# Altium project VNA.PrjPcb
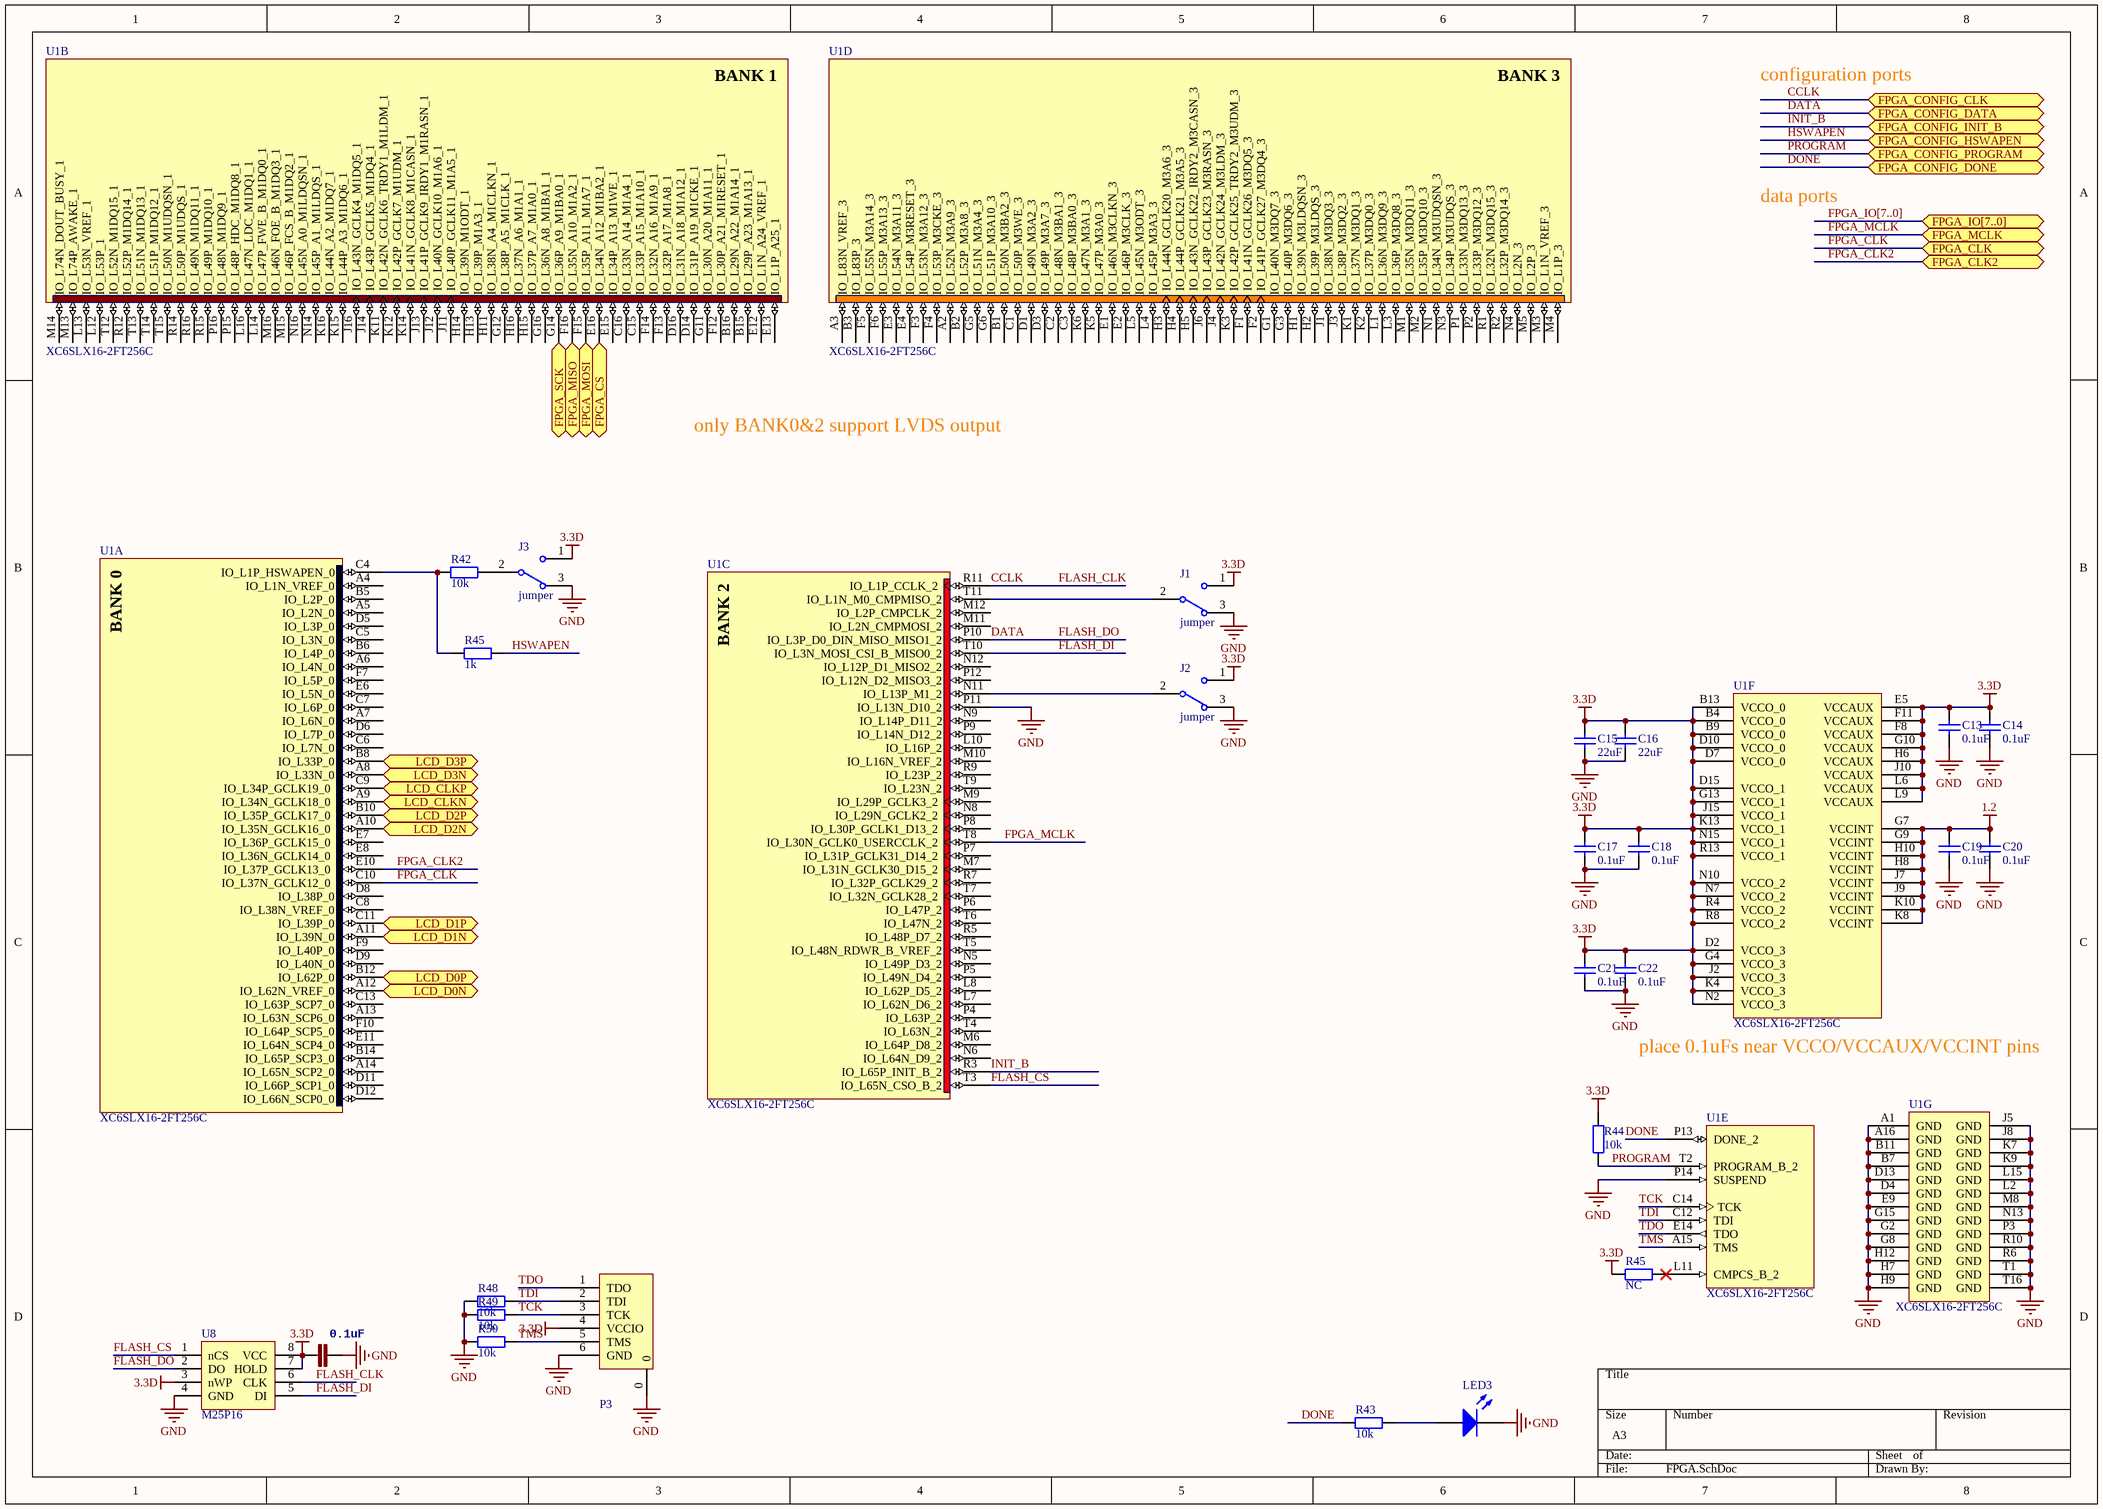
[diagram p0: FPGA.SchDoc]
16 sheets, 580 parts. Net scope: hierarchical (ports join the sheet entries above them; power ports are global).
Board file: VNA.PcbDoc
Sheets:
  FPGA.SchDoc
  mcu.SchDoc
  LCD.SchDoc
  USB_HS_PHY.SchDoc
  channel.SchDoc
    IF1 = IF_amp.SchDoc
    Designator = ADC.SchDoc
    IF2 = IF_amp.SchDoc
    mixer1 = mixer.SchDoc
    mixer2 = mixer.SchDoc
    LO = source.SchDoc
    F1 = filter_bank.SchDoc
    B1 = Balun.SchDoc
    B1 = Balun.SchDoc
    F2 = filter_bank.SchDoc
    TX = source.SchDoc
    F1 = filter_bank.SchDoc
    F2 = RF_AMP.SchDoc
    F1 = filter_bank.SchDoc
    det = detector.SchDoc
    att = attenuator.SchDoc
    sw = port_sw.SchDoc
    LNA2 = LNA.SchDoc
    LNA2 = LNA.SchDoc

## Sheet FPGA.SchDoc
size A3

### Parts
(Parts that share a designator on the sheet are numbered #1, #2 ... from top to bottom, then left to right.)
C13  0.1uF  [0402]
C14  0.1uF  [0402]
C15  value 22uF  [0805]  (hidden comment: Cap)
C16  value 22uF  [0805]  (hidden comment: Cap)
C17  0.1uF  [0402]
C18  0.1uF  [0402]
C19  0.1uF  [0402]
C20  0.1uF  [0402]
C21  0.1uF  [0402]
C22  0.1uF  [0402]
C68  0.1uF  [0402]
J1  jumper  [0402J]
J2  jumper  [0402J]
J3  jumper  [0402J]
LED3  LED0  [0603]  (value not drawn)
P3  JTAG-6P  [GH1.25-6]  (value not drawn)
R42  10k  [0402]
R43  10k  [0402]
R44  10k  [0402]
R45#1  1k  [0402]
R45#2  NC  [0402]
R48  10k  [0402]
R49  10k  [0402]
R50  10k  [0402]
U1  XC6SLX16-2FT256C  [FT256]  (parts A,B,C,D,E,F,G of 7)
U8  M25P16  [SO8]

### Ports
FPGA_CLK, FPGA_CLK2, FPGA_CONFIG_CLK, FPGA_CONFIG_DATA, FPGA_CONFIG_DONE, FPGA_CONFIG_HSWAPEN, FPGA_CONFIG_INIT_B, FPGA_CONFIG_PROGRAM, FPGA_CS, FPGA_IO[7..0], FPGA_MCLK, FPGA_MISO, FPGA_MOSI, FPGA_SCK, LCD_CLKN, LCD_CLKP, LCD_D0N, LCD_D0P, LCD_D1N, LCD_D1P, LCD_D2N, LCD_D2P, LCD_D3N, LCD_D3P

### Nets
1.2: C19.1 C20.1 U1.G7(VCCINT) U1.G9(VCCINT) U1.H8(VCCINT) U1.H10(VCCINT) U1.J7(VCCINT) U1.J9(VCCINT) U1.K8(VCCINT) U1.K10(VCCINT)
3.3D: C13.1 C14.1 C15.2 C16.2 C17.1 C18.1 C21.1 C22.1 C68.2 J1.1 J2.1 J3.1 P3.4(VCCIO) R44.1 R45#2.2 U1.B4(VCCO_0) U1.B9(VCCO_0) U1.B13(VCCO_0) U1.D2(VCCO_3) U1.D7(VCCO_0) U1.D10(VCCO_0) U1.D15(VCCO_1) U1.E5(VCCAUX) U1.F8(VCCAUX) U1.F11(VCCAUX) U1.G4(VCCO_3) U1.G10(VCCAUX) U1.G13(VCCO_1) U1.H6(VCCAUX) U1.J2(VCCO_3) U1.J10(VCCAUX) U1.J15(VCCO_1) U1.K4(VCCO_3) U1.K13(VCCO_1) U1.L6(VCCAUX) U1.L9(VCCAUX) U1.N2(VCCO_3) U1.N7(VCCO_2) U1.N10(VCCO_2) U1.N15(VCCO_1) U1.R4(VCCO_2) U1.R8(VCCO_2) U1.R13(VCCO_1) U8.3(nWP) U8.7(HOLD) U8.8(VCC)
GND: C13.2 C14.2 C15.1 C16.1 C17.2 C18.2 C19.2 C20.2 C21.2 C22.2 C68.1 J1.3 J2.3 J3.3 LED3.2(K) P3.0 P3.6(GND) R48.2 R49.2 R50.2 U1.A1(GND) U1.A16(GND) U1.B7(GND) U1.B11(GND) U1.D4(GND) U1.D13(GND) U1.E9(GND) U1.G2(GND) U1.G8(GND) U1.G15(GND) U1.H7(GND) U1.H9(GND) U1.H12(GND) U1.J5(GND) U1.J8(GND) U1.K7(GND) U1.K9(GND) U1.L2(GND) U1.L15(GND) U1.M8(GND) U1.N13(GND) U1.P3(GND) U1.P11(IO_L13N_D10_2) U1.P14(SUSPEND) U1.R6(GND) U1.R10(GND) U1.T1(GND) U1.T16(GND) U8.4(GND)
CCLK: U1.R11(IO_L1P_CCLK_2) U8.6(CLK) ; port FPGA_CONFIG_CLK  [also labelled FLASH_CLK]
DATA: U1.P10(IO_L3P_D0_DIN_MISO_MISO1_2) U8.2(DO) ; port FPGA_CONFIG_DATA  [also labelled FLASH_DO]
DONE: R43.1 U1.P13(DONE_2) ; port FPGA_CONFIG_DONE
FLASH_CS: U1.T3(IO_L65N_CSO_B_2) U8.1(nCS)
FLASH_DI: U1.T10(IO_L3N_MOSI_CSI_B_MISO0_2) U8.5(DI)
FPGA_CLK: U1.C10(IO_L37N_GCLK12_0) ; port FPGA_CLK
FPGA_CLK2: U1.E10(IO_L37P_GCLK13_0) ; port FPGA_CLK2
FPGA_MCLK: U1.T8(IO_L30N_GCLK0_USERCCLK_2) ; port FPGA_MCLK
HSWAPEN: R45#1.1 ; port FPGA_CONFIG_HSWAPEN
INIT_B: U1.R3(IO_L65P_INIT_B_2) ; port FPGA_CONFIG_INIT_B
PROGRAM: R44.2 U1.T2(PROGRAM_B_2) ; port FPGA_CONFIG_PROGRAM
TCK: P3.3(TCK) R49.1 U1.C14(TCK)
TDI: P3.2(TDI) R48.1 U1.C12(TDI)
TDO: P3.1(TDO) U1.E14(TDO)
TMS: P3.5(TMS) R50.1 U1.A15(TMS)
NetJ1_2: J1.2 U1.T11(IO_L1N_M0_CMPMISO_2)
NetJ2_2: J2.2 U1.N11(IO_L13P_M1_2)
NetJ3_2: J3.2 R42.1
NetLED3_1: LED3.1(A) R43.2
NetR42_2: R42.2 R45#1.2 U1.C4(IO_L1P_HSWAPEN_0)
NetR45#2_1: R45#2.1 U1.L11(CMPCS_B_2)
NetU1_A8: U1.A8(IO_L33N_0) ; port LCD_D3N
NetU1_A9: U1.A9(IO_L34N_GCLK18_0) ; port LCD_CLKN
NetU1_A10: U1.A10(IO_L35N_GCLK16_0) ; port LCD_D2N
NetU1_A11: U1.A11(IO_L39N_0) ; port LCD_D1N
NetU1_A12: U1.A12(IO_L62N_VREF_0) ; port LCD_D0N
NetU1_B8: U1.B8(IO_L33P_0) ; port LCD_D3P
NetU1_B10: U1.B10(IO_L35P_GCLK17_0) ; port LCD_D2P
NetU1_B12: U1.B12(IO_L62P_0) ; port LCD_D0P
NetU1_C9: U1.C9(IO_L34P_GCLK19_0) ; port LCD_CLKP
NetU1_C11: U1.C11(IO_L39P_0) ; port LCD_D1P
NetU1_E16: U1.E16(IO_L34N_A12_M1BA2_1) ; port FPGA_CS
NetU1_F15: U1.F15(IO_L35P_A11_M1A7_1) ; port FPGA_MOSI
NetU1_F16: U1.F16(IO_L35N_A10_M1A2_1) ; port FPGA_MISO
NetU1_G14: U1.G14(IO_L36P_A9_M1BA0_1) ; port FPGA_SCK

Not connected (* = marked no-connect by the designer): U1 A2(IO_L52N_M3A9_3) A3(IO_L83N_VREF_3) A4(IO_L1N_VREF_0) A5(IO_L2N_0) A6(IO_L4N_0) A7(IO_L6N_0) A13(IO_L63N_SCP6_0) A14(IO_L65N_SCP2_0) B1(IO_L50N_M3BA2_3) B2(IO_L52P_M3A8_3) B3(IO_L83P_3) B5(IO_L2P_0) B6(IO_L4P_0) B14(IO_L65P_SCP3_0) B15(IO_L29P_A23_M1A13_1) B16(IO_L29N_A22_M1A14_1) C1(IO_L50P_M3WE_3) C2(IO_L48N_M3BA1_3) C3(IO_L48P_M3BA0_3) C5(IO_L3N_0) C6(IO_L7N_0) C7(IO_L6P_0) C8(IO_L38N_VREF_0) C13(IO_L63P_SCP7_0) C15(IO_L33P_A15_M1A10_1) C16(IO_L33N_A14_M1A4_1) D1(IO_L49N_M3A2_3) D3(IO_L49P_M3A7_3) D5(IO_L3P_0) D6(IO_L7P_0) D8(IO_L38P_0) D9(IO_L40N_0) D11(IO_L66P_SCP1_0) D12(IO_L66N_SCP0_0) D14(IO_L31P_A19_M1CKE_1) D16(IO_L31N_A18_M1A12_1) E1(IO_L46N_M3CLKN_3) E2(IO_L46P_M3CLK_3) E3(IO_L54N_M3A11_3) E4(IO_L54P_M3RESET_3) E6(IO_L5N_0) E7(IO_L36P_GCLK15_0) E8(IO_L36N_GCLK14_0) E11(IO_L64N_SCP4_0) E12(IO_L1N_A24_VREF_1) E13(IO_L1P_A25_1) E15(IO_L34P_A13_M1WE_1) F1(IO_L41N_GCLK26_M3DQ5_3) F2(IO_L41P_GCLK27_M3DQ4_3) F3(IO_L53N_M3A12_3) F4(IO_L53P_M3CKE_3) F5(IO_L55N_M3A14_3) F6(IO_L55P_M3A13_3) F7(IO_L5P_0) F9(IO_L40P_0) F10(IO_L64P_SCP5_0) F12(IO_L30P_A21_M1RESET_1) F13(IO_L32P_A17_M1A8_1) F14(IO_L32N_A16_M1A9_1) G1(IO_L40N_M3DQ7_3) G3(IO_L40P_M3DQ6_3) G5(IO_L51N_M3A4_3) G6(IO_L51P_M3A10_3) G11(IO_L30N_A20_M1A11_1) G12(IO_L38P_A5_M1CLK_1) G16(IO_L36N_A8_M1BA1_1) H1(IO_L39N_M3LDQSN_3) H2(IO_L39P_M3LDQS_3) H3(IO_L44N_GCLK20_M3A6_3) H4(IO_L44P_GCLK21_M3A5_3) H5(IO_L43N_GCLK22_IRDY2_M3CASN_3) H11(IO_L38N_A4_M1CLKN_1) H13(IO_L39P_M1A3_1) H14(IO_L39N_M1ODT_1) H15(IO_L37P_A7_M1A0_1) H16(IO_L37N_A6_M1A1_1) J1(IO_L38N_M3DQ3_3) J3(IO_L38P_M3DQ2_3) J4(IO_L42N_GCLK24_M3LDM_3) J6(IO_L43P_GCLK23_M3RASN_3) J11(IO_L40P_GCLK11_M1A5_1) J12(IO_L40N_GCLK10_M1A6_1) J13(IO_L41P_GCLK9_IRDY1_M1RASN_1) J14(IO_L43P_GCLK5_M1DQ4_1) J16(IO_L43N_GCLK4_M1DQ5_1) K1(IO_L37N_M3DQ1_3) K2(IO_L37P_M3DQ0_3) K3(IO_L42P_GCLK25_TRDY2_M3UDM_3) K5(IO_L47P_M3A0_3) K6(IO_L47N_M3A1_3) K11(IO_L42N_GCLK6_TRDY1_M1LDM_1) K12(IO_L42P_GCLK7_M1UDM_1) K14(IO_L41N_GCLK8_M1CASN_1) K15(IO_L44P_A3_M1DQ6_1) K16(IO_L44N_A2_M1DQ7_1) L1(IO_L36N_M3DQ9_3) L3(IO_L36P_M3DQ8_3) L4(IO_L45P_M3A3_3) L5(IO_L45N_M3ODT_3) L7(IO_L62N_D6_2) L8(IO_L62P_D5_2) L10(IO_L16P_2) L12(IO_L53P_1) L13(IO_L53N_VREF_1) L14(IO_L47P_FWE_B_M1DQ0_1) L16(IO_L47N_LDC_M1DQ1_1) M1(IO_L35N_M3DQ11_3) M2(IO_L35P_M3DQ10_3) M3(IO_L1N_VREF_3) M4(IO_L1P_3) M5(IO_L2P_3) M6(IO_L64P_D8_2) M7(IO_L31N_GCLK30_D15_2) M9(IO_L29P_GCLK3_2) M10(IO_L16N_VREF_2) M11(IO_L2N_CMPMOSI_2) M12(IO_L2P_CMPCLK_2) M13(IO_L74P_AWAKE_1) M14(IO_L74N_DOUT_BUSY_1) M15(IO_L46P_FCS_B_M1DQ2_1) M16(IO_L46N_FOE_B_M1DQ3_1) N1(IO_L34N_M3UDQSN_3) N3(IO_L34P_M3UDQS_3) N4(IO_L2N_3) N5(IO_L49P_D3_2) N6(IO_L64N_D9_2) N8(IO_L29N_GCLK2_2) N9(IO_L14P_D11_2) N12(IO_L12P_D1_MISO2_2) N14(IO_L45P_A1_M1LDQS_1) N16(IO_L45N_A0_M1LDQSN_1) P1(IO_L33N_M3DQ13_3) P2(IO_L33P_M3DQ12_3) P4(IO_L63P_2) P5(IO_L49N_D4_2) P6(IO_L47P_2) P7(IO_L31P_GCLK31_D14_2) P8(IO_L30P_GCLK1_D13_2) P9(IO_L14N_D12_2) P12(IO_L12N_D2_MISO3_2) P15(IO_L48P_HDC_M1DQ8_1) P16(IO_L48N_M1DQ9_1) R1(IO_L32N_M3DQ15_3) R2(IO_L32P_M3DQ14_3) R5(IO_L48P_D7_2) R7(IO_L32P_GCLK29_2) R9(IO_L23P_2) R12(IO_L52P_M1DQ14_1) R14(IO_L50P_M1UDQS_1) R15(IO_L49P_M1DQ10_1) R16(IO_L49N_M1DQ11_1) T4(IO_L63N_2) T5(IO_L48N_RDWR_B_VREF_2) T6(IO_L47N_2) T7(IO_L32N_GCLK28_2) T9(IO_L23N_2) T12(IO_L52N_M1DQ15_1) T13(IO_L51N_M1DQ13_1) T14(IO_L51P_M1DQ12_1) T15(IO_L50N_M1UDQSN_1)

### Buses and harness runs
bus FPGA_IO[7..0] = port FPGA_IO[7..0]

### Notes on the sheet
- configuration ports
- data ports
- only BANK0&2 support LVDS output
- (near U1) place 0.1uFs near VCCO/VCCAUX/VCCINT pins
- (in symbol XC6SLX16-2FT256C, part A) BANK 0
- (in symbol XC6SLX16-2FT256C, part B) BANK 1
- (in symbol XC6SLX16-2FT256C, part C) BANK 2
- (in symbol XC6SLX16-2FT256C, part D) BANK 3

### Library data of the parts
C13-C22 = Cap: Capacitor; Published: 8-Jun-2000; LatestRevisionDate: 17-Jul-2002; LatestRevisionNote: Re-released for DXP Platform.; PackageReference: RAD-0.3; Publisher: Altium Limited; PackageDescription: Radial Cap, Thru-Hole; 2 Leads; 0.3 in Pin Spacing
C68 = CAP0402-CAP: <b>Capacitor</b> / Standard 0603 ceramic capacitor, and 0.1" leaded capacitor.; PARTNO: CC0402ZRY5V7BB104
J1-J3 = SW-SPDT: SPDT Subminiature Toggle Switch, Right Angle Mounting, Vertical Actuation; Published: 24-Mar-1999; LatestRevisionDate: 17-Dec-2003; LatestRevisionNote: Schematic revised, PCB Footprint replaced.; DatasheetVersion: 05-Dec-2000; PackageReference: TL36WW15050; Publisher: Altium Limited; PackageDescription: Switch; 4 Leads; ComponentLink1Description: Manufacturer Link; ComponentLink1URL: http://www.apem.com
LED3 = LED0: Typical INFRARED GaAs LED; Published: 8-Jun-2000; LatestRevisionDate: 08-Jul-2005; LatestRevisionNote: Mech Layer 1 removed.; PackageReference: LED-0; Publisher: Altium Limited; PackageDescription: LED; 2 Leads
R42-R44 R45#1 R45#2 R48-R50 = Res2: Resistor; Published: 8-Jun-2000; LatestRevisionDate: 17-Jul-2002; LatestRevisionNote: Re-released for DXP Platform.; PackageReference: AXIAL-0.4; Publisher: Altium Limited; PackageDescription: Axial Device, Thru-Hole; 2 Leads; 0.4 in Pin Spacing
U1 = XC6SLX16-2FT256C: Spartan-6 LX 1.2V FPGA, 186 User I/Os, 256-Ball Fine-Pitch Thin BGA (1.0mm Pitch), Speed Grade 2, Commercial Grade; Published: 17-Nov-2009; DatasheetVersion: ver1.6, Nov-2010; PackageVersion: ver1.3, Oct-2007; PackageReference: FT256; Publisher: Altium Limited; PackageDescription: 256-Ball Fine Pitch Thin Ball Grid Array 1.00 mm Pitch (FT256); Code_JEDEC: MS-034-AAF-1*; ComponentLink1Description: Manufacturer Link; ComponentLink1URL: http://www.xilinx.com; ComponentLink2Description: Spartan-6 Datasheet; ComponentLink2URL: http://www.xilinx.com/support/documentation/data_sheets/ds160.pdf; ComponentLink3Description: Spartan-6 Documents; ComponentLink3URL: http://www.xilinx.com/support/documentation/spartan-6.htm; ComponentLink4Description: Xilinx.com Home; ComponentLink4URL: http://www.xilinx.com

## Sheet mcu.SchDoc
size A4
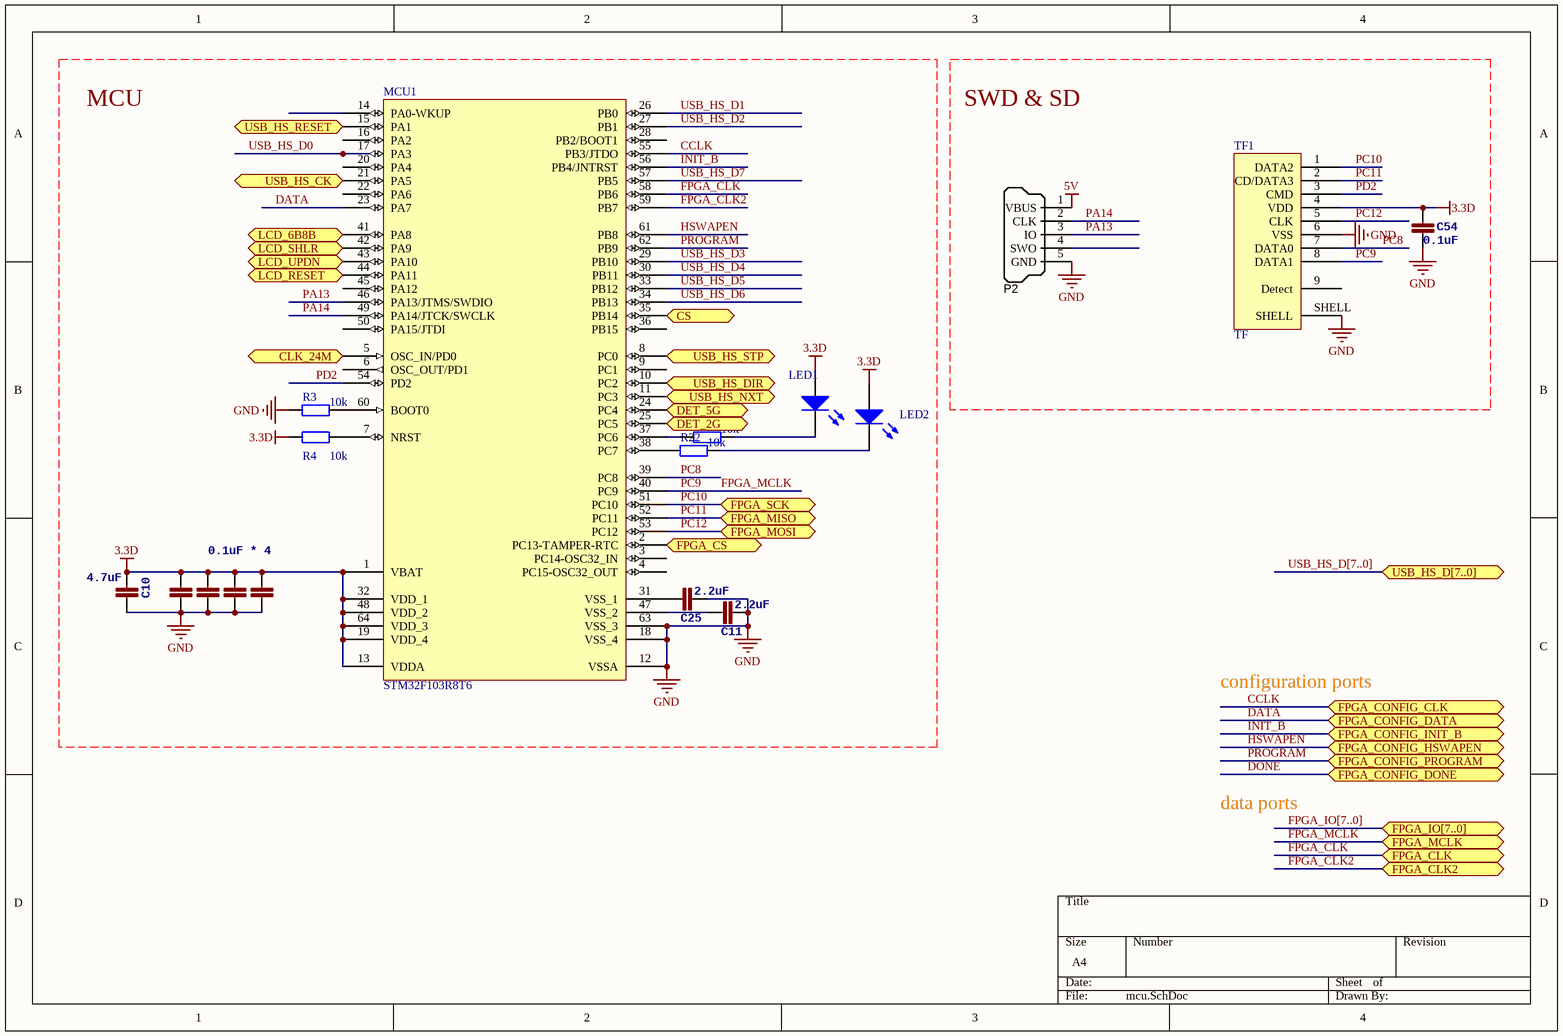
[diagram p1: mcu.SchDoc]

### Parts
C4  0.1uF * 4  [0402]
C5  1n  [0402]  (value not drawn)
C6  1n  [0402]  (value not drawn)
C7  1n  [0402]  (value not drawn)
C10  4.7uF  [0603]
C11  2.2uF  [0603]
C25  2.2uF  [0603]
C54  0.1uF  [0402]
LED1  LED0  [0603]  (value not drawn)
LED2  LED0  [0603]  (value not drawn)
MCU1  STM32F103R8T6  [LQFP64_N]
P2  SWD_MicroUSB  [MICRO-YZX]  (value not drawn)
R3  10k  [0402]
R4  10k  [0402]
R21  10k  [0402]
R22  10k  [0402]
TF1  TF  [TF]

### Ports
CLK_24M, CS, DET_2G, DET_5G, FPGA_CLK, FPGA_CLK2, FPGA_CONFIG_CLK, FPGA_CONFIG_DATA, FPGA_CONFIG_DONE, FPGA_CONFIG_HSWAPEN, FPGA_CONFIG_INIT_B, FPGA_CONFIG_PROGRAM, FPGA_CS, FPGA_IO[7..0], FPGA_MCLK, FPGA_MISO, FPGA_MOSI, FPGA_SCK, LCD_6B8B, LCD_RESET, LCD_SHLR, LCD_UPDN, USB_HS_CK, USB_HS_D[7..0], USB_HS_DIR, USB_HS_NXT, USB_HS_RESET, USB_HS_STP

### Nets
3.3D: C4.2 C5.2 C6.2 C7.2 C10.2 C54.2 LED1.1(A) LED2.1(A) MCU1.1(VBAT) MCU1.13(VDDA) MCU1.19(VDD_4) MCU1.32(VDD_1) MCU1.48(VDD_2) MCU1.64(VDD_3) R4.2 TF1.4(VDD)
5V: P2.1(VBUS)
GND: C4.1 C5.1 C6.1 C7.1 C10.1 C11.2 C25.2 C54.1 MCU1.12(VSSA) MCU1.18(VSS_4) MCU1.63(VSS_3) P2.5(GND) R3.1 TF1.6(VSS) TF1.SHELL
CCLK: MCU1.55(PB3/JTDO) ; port FPGA_CONFIG_CLK
DATA: MCU1.23(PA7) ; port FPGA_CONFIG_DATA
DONE: port FPGA_CONFIG_DONE
FPGA_CLK: MCU1.58(PB6) ; port FPGA_CLK
FPGA_CLK2: MCU1.59(PB7) ; port FPGA_CLK2
FPGA_MCLK: MCU1.40(PC9) TF1.8(DATA1) ; port FPGA_MCLK  [also labelled PC9]
HSWAPEN: MCU1.61(PB8) ; port FPGA_CONFIG_HSWAPEN
INIT_B: MCU1.56(PB4/JNTRST) ; port FPGA_CONFIG_INIT_B
PA13: MCU1.46(PA13/JTMS/SWDIO) P2.3(IO)
PA14: MCU1.49(PA14/JTCK/SWCLK) P2.2(CLK)
PC8: MCU1.39(PC8) TF1.7(DATA0)
PC10: MCU1.51(PC10) TF1.1(DATA2) ; port FPGA_SCK
PC11: MCU1.52(PC11) TF1.2(CD/DATA3) ; port FPGA_MISO
PC12: MCU1.53(PC12) TF1.5(CLK) ; port FPGA_MOSI
PD2: MCU1.54(PD2) TF1.3(CMD)
PROGRAM: MCU1.62(PB9) ; port FPGA_CONFIG_PROGRAM
USB_HS_D0: MCU1.17(PA3)
USB_HS_D1: MCU1.26(PB0)
USB_HS_D2: MCU1.27(PB1)
USB_HS_D3: MCU1.29(PB10)
USB_HS_D4: MCU1.30(PB11)
USB_HS_D5: MCU1.33(PB12)
USB_HS_D6: MCU1.34(PB13)
USB_HS_D7: MCU1.57(PB5)
NetC11_1: C11.1 MCU1.47(VSS_2)
NetC25_1: C25.1 MCU1.31(VSS_1)
NetLED1_2: LED1.2(K) R21.2
NetLED2_2: LED2.2(K) R22.2
NetMCU1_2: MCU1.2(PC13-TAMPER-RTC) ; port FPGA_CS
NetMCU1_5: MCU1.5(OSC_IN/PD0) ; port CLK_24M
NetMCU1_7: MCU1.7(NRST) R4.1
NetMCU1_8: MCU1.8(PC0) ; port USB_HS_STP
NetMCU1_10: MCU1.10(PC2) ; port USB_HS_DIR
NetMCU1_11: MCU1.11(PC3) ; port USB_HS_NXT
NetMCU1_15: MCU1.15(PA1) ; port USB_HS_RESET
NetMCU1_21: MCU1.21(PA5) ; port USB_HS_CK
NetMCU1_24: MCU1.24(PC4) ; port DET_5G
NetMCU1_25: MCU1.25(PC5) ; port DET_2G
NetMCU1_35: MCU1.35(PB14) ; port CS
NetMCU1_37: MCU1.37(PC6) R21.1
NetMCU1_38: MCU1.38(PC7) R22.1
NetMCU1_41: MCU1.41(PA8) ; port LCD_6B8B
NetMCU1_42: MCU1.42(PA9) ; port LCD_SHLR
NetMCU1_43: MCU1.43(PA10) ; port LCD_UPDN
NetMCU1_44: MCU1.44(PA11) ; port LCD_RESET
NetMCU1_60: MCU1.60(BOOT0) R3.2

Not connected (* = marked no-connect by the designer): MCU1 3(PC14-OSC32_IN) 4(PC15-OSC32_OUT) 6(OSC_OUT/PD1) 9(PC1) 14(PA0-WKUP) 16(PA2) 20(PA4) 22(PA6) 28(PB2/BOOT1) 36(PB15) 45(PA12) 50(PA15/JTDI); P2 4(SWO); TF1 9(Detect)

### Buses and harness runs
bus FPGA_IO[7..0] = port FPGA_IO[7..0]
bus USB_HS_D[7..0] = port USB_HS_D[7..0]

### Notes on the sheet
- MCU
- SWD & SD
- configuration ports
- data ports

### Library data of the parts
C4-C7 C10 C11 C25 C54 = CAP0402-CAP: as C68 on sheet FPGA
LED1 LED2 = LED0: Typical INFRARED GaAs LED; Published: 8-Jun-2000; LatestRevisionDate: 08-Jul-2005; LatestRevisionNote: Mech Layer 1 removed.; PackageReference: LED-0; Publisher: Altium Limited; PackageDescription: LED; 2 Leads
MCU1 = STM32F103R8T6: STM32 ARM-based 32-bit MCU with 64 Kbytes Flash, 64-pin LQFP, Industrial Temperature; Published: *; DatasheetVersion: *; PackageVersion: *; PackageReference: *; Publisher: *; PackageDescription: *; ComponentLink1Description: *; ComponentLink1URL: *; ComponentLink2Description: *; ComponentLink2URL: *
P2 = SWD_MicroUSB: Connector SMD USB Micro Type B middle mount; Manufacturer 1: Molex Inc; SCDType: undef; Package / Case: SMD; Supplier 1: Digi-Key; Supplier Part Number 1: WM17142CT-ND
R3 R4 R21 R22 = Res2: Resistor; Value: 0Ohm; Published: 8-Jun-2000; LatestRevisionDate: 17-Jul-2002; LatestRevisionNote: Re-released for DXP Platform.; PackageReference: AXIAL-0.4; Publisher: Altium Limited; PackageDescription: Axial Device, Thru-Hole; 2 Leads; 0.4 in Pin Spacing

## Sheet LCD.SchDoc
size A4
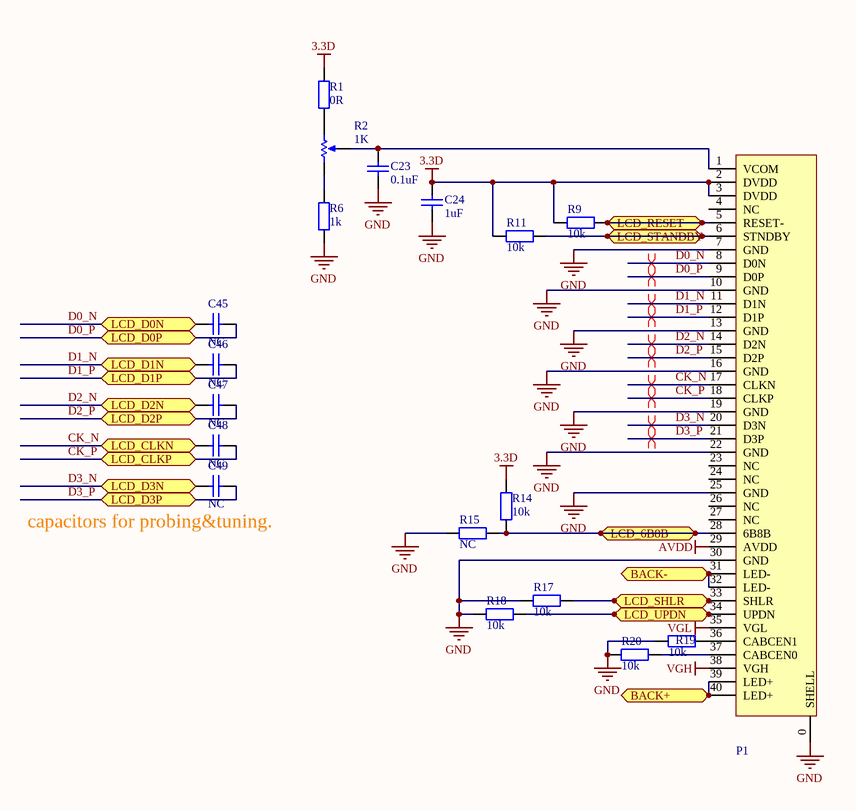
[diagram p2: LCD.SchDoc]

### Parts
C23  0.1uF  [0402]
C24  1uF  [0402]
C45  NC  [0402]
C46  NC  [0402]
C47  NC  [0402]
C48  NC  [0402]
C49  NC  [0402]
P1  LCD_40P_LVDS  [FPC-0.5mm-40]  (value not drawn)
R1  0R  [0402]
R2  value 1K  [POT1]  (hidden comment: RPot)
R6  1k  [0402]
R9  10k  [0402]
R11  10k  [0402]
R14  10k  [0402]
R15  NC  [0402]
R17  10k  [0402]
R18  10k  [0402]
R19  10k  [0402]
R20  10k  [0402]

### Ports
BACK+, BACK-, LCD_6B8B, LCD_CLKN, LCD_CLKP, LCD_D0N, LCD_D0P, LCD_D1N, LCD_D1P, LCD_D2N, LCD_D2P, LCD_D3N, LCD_D3P, LCD_RESET, LCD_SHLR, LCD_STANDBY, LCD_UPDN

### Nets
3.3D: C24.1 P1.2(DVDD) P1.3(DVDD) R1.2 R9.1 R11.1 R14.2
AVDD: P1.29(AVDD)
GND: C23.2 C24.2 P1.0(SHELL) P1.7(GND) P1.10(GND) P1.13(GND) P1.16(GND) P1.19(GND) P1.22(GND) P1.25(GND) P1.30(GND) R6.1 R15.1 R17.1 R18.1 R19.1 R20.1
VGH: P1.38(VGH)
VGL: P1.35(VGL)
CK_N: C48.1 P1.17(CLKN) ; port LCD_CLKN
CK_P: C48.2 P1.18(CLKP) ; port LCD_CLKP
D0_N: C45.1 P1.8(D0N) ; port LCD_D0N
D0_P: C45.2 P1.9(D0P) ; port LCD_D0P
D1_N: C46.1 P1.11(D1N) ; port LCD_D1N
D1_P: C46.2 P1.12(D1P) ; port LCD_D1P
D2_N: C47.1 P1.14(D2N) ; port LCD_D2N
D2_P: C47.2 P1.15(D2P) ; port LCD_D2P
D3_N: C49.1 P1.20(D3N) ; port LCD_D3N
D3_P: C49.2 P1.21(D3P) ; port LCD_D3P
NetC23_1: C23.1 P1.1(VCOM) R2.3(TAP)
NetP1_5: P1.5(RESET-) R9.2 ; port LCD_RESET
NetP1_6: P1.6(STNDBY) R11.2 ; port LCD_STANDBY
NetP1_28: P1.28(6B8B) R14.1 R15.2 ; port LCD_6B8B
NetP1_31: P1.31(LED-) P1.32(LED-) ; port BACK-
NetP1_33: P1.33(SHLR) R17.2 ; port LCD_SHLR
NetP1_34: P1.34(UPDN) R18.2 ; port LCD_UPDN
NetP1_36: P1.36(CABCEN1) R19.2
NetP1_37: P1.37(CABCEN0) R20.2
NetP1_39: P1.39(LED+) P1.40(LED+) ; port BACK+
NetR1_1: R1.1 R2.2(BOT)
NetR2_1: R2.1(TOP) R6.2

Not connected (* = marked no-connect by the designer): P1 4(NC) 23(NC) 24(NC) 26(NC) 27(NC)

### Layout directives
differential pair: CK_N, CK_P, D0_N, D0_P, D1_N, D1_P, D2_N, D2_P, D3_N, D3_P

### Notes on the sheet
- (near C49) capacitors for probing&tuning.

### Library data of the parts
C23 C24 C45-C49 = Cap: Capacitor; Published: 8-Jun-2000; LatestRevisionDate: 17-Jul-2002; LatestRevisionNote: Re-released for DXP Platform.; PackageReference: RAD-0.3; Publisher: Altium Limited; PackageDescription: Radial Cap, Thru-Hole; 2 Leads; 0.3 in Pin Spacing
R1 R6 R9 R11 R14 R15 R17-R20 = Res2: Resistor; Published: 8-Jun-2000; LatestRevisionDate: 17-Jul-2002; LatestRevisionNote: Re-released for DXP Platform.; PackageReference: AXIAL-0.4; Publisher: Altium Limited; PackageDescription: Axial Device, Thru-Hole; 2 Leads; 0.4 in Pin Spacing
R2 = RPot: Potentiometer; Sim Note: Enter the Resistance value and the set point into parameter fields.; Set Position: 0.5; Published: 8-Jun-2000; LatestRevisionDate: 17-Jul-2002; LatestRevisionNote: Re-released for DXP Platform.; PackageReference: VR5; Publisher: Altium Limited; PackageDescription: Variable Resistor, Thru-Hole; 3 Leads

## Sheet USB_HS_PHY.SchDoc
size A4
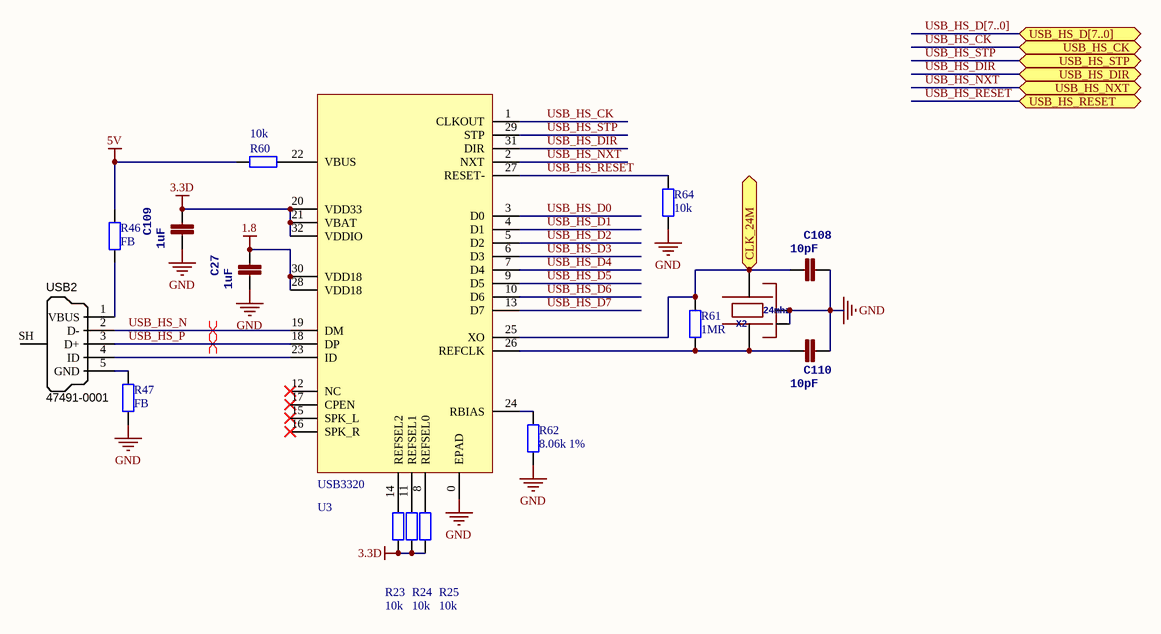
[diagram p3: USB_HS_PHY.SchDoc]

### Parts
C27  1uF  [0402]
C108  10pF  [0402]
C109  1uF  [0402]
C110  10pF  [0402]
R23  10k  [0402]
R24  10k  [0402]
R25  10k  [0402]
R46  FB  [0603]
R47  FB  [0603]
R60  10k  [0402]
R61  1MR  [0402]
R62  8.06k 1%  [0402]
R64  10k  [0402]
U3  USB3320  [USB3300]
USB2  Manufacturer Part Number 1: 47491-0001  [MICRO-YZX]  (hidden comment: USB Micro Type B)
X2  24mhz  [OSCILLATOR-3.2X2.5]

### Ports
CLK_24M, USB_HS_CK, USB_HS_D[7..0], USB_HS_DIR, USB_HS_NXT, USB_HS_RESET, USB_HS_STP

### Nets
1.8: C27.1 U3.28(VDD18) U3.30(VDD18)
3.3D: C109.1 R23.2 R24.2 R25.2 U3.20(VDD33) U3.21(VBAT) U3.32(VDDIO)
5V: R46.1 R60.1
GND: C27.2 C108.1 C109.2 C110.1 R47.2 R62.1 R64.2 U3.0(EPAD) X2.2(NC_2) X2.4(NC_4)
USB_HS_CK: U3.1(CLKOUT) ; port USB_HS_CK
USB_HS_D0: U3.3(D0)
USB_HS_D1: U3.4(D1)
USB_HS_D2: U3.5(D2)
USB_HS_D3: U3.6(D3)
USB_HS_D4: U3.7(D4)
USB_HS_D5: U3.9(D5)
USB_HS_D6: U3.10(D6)
USB_HS_D7: U3.13(D7)
USB_HS_DIR: U3.31(DIR) ; port USB_HS_DIR
USB_HS_N: U3.19(DM) USB2.2(D-)
USB_HS_NXT: U3.2(NXT) ; port USB_HS_NXT
USB_HS_P: U3.18(DP) USB2.3(D+)
USB_HS_RESET: R64.1 U3.27(RESET-) ; port USB_HS_RESET
USB_HS_STP: U3.29(STP) ; port USB_HS_STP
NetC108_2: C108.2 R61.2 U3.25(XO) X2.3 ; port CLK_24M
NetC110_2: C110.2 R61.1 U3.26(REFCLK) X2.1
NetR23_1: R23.1 U3.14(REFSEL2)
NetR24_1: R24.1 U3.11(REFSEL1)
NetR25_1: R25.1 U3.8(REFSEL0)
NetR46_2: R46.2 USB2.1(VBUS)
NetR47_1: R47.1 USB2.5(GND)
NetR60_2: R60.2 U3.22(VBUS)
NetR62_2: R62.2 U3.24(RBIAS)
NetU3_23: U3.23(ID) USB2.4(ID)

Not connected (* = marked no-connect by the designer): U3 12(NC)* 15(SPK_L)* 16(SPK_R)* 17(CPEN)*; USB2 SH(Shell)

### Buses and harness runs
bus USB_HS_D[7..0] = port USB_HS_D[7..0]

### Layout directives
differential pair: USB_HS_N, USB_HS_P

### Library data of the parts
C27 C108-C110 = CAP0402-CAP: as C68 on sheet FPGA
R23-R25 R46 R47 R60-R62 R64 = Res2: Resistor; Value: 0Ohm; Published: 8-Jun-2000; LatestRevisionDate: 17-Jul-2002; LatestRevisionNote: Re-released for DXP Platform.; PackageReference: AXIAL-0.4; Publisher: Altium Limited; PackageDescription: Axial Device, Thru-Hole; 2 Leads; 0.4 in Pin Spacing
USB2 = USB_Micro_TypeB: Connector SMD USB Micro Type B middle mount; Manufacturer 1: Molex Inc; SCDType: undef; Package / Case: SMD; Supplier 1: Digi-Key; Supplier Part Number 1: WM17142CT-ND
X2 = OSCILLATOR-3.2X2.5: Crystal Oscillator in 3.2x2.5 SMD

## Sheet channel.SchDoc
size A4
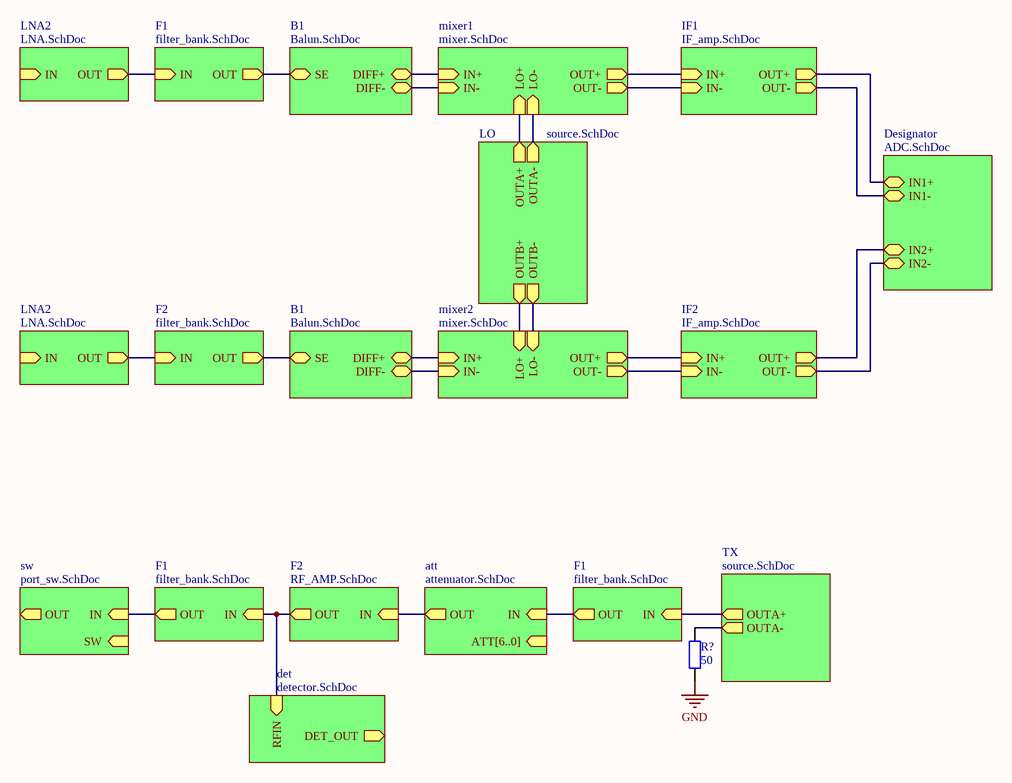
[diagram p4: channel.SchDoc]

### Parts
R?  50  [0402]

### Sub-sheets
att = attenuator.SchDoc: IN (in), OUT (out), ATT[6..0] (in)
B1 = Balun.SchDoc: SE (bidir), DIFF+ (bidir), DIFF- (bidir)
B1 = Balun.SchDoc: SE (bidir), DIFF+ (bidir), DIFF- (bidir)
Designator = ADC.SchDoc: IN1+, IN1-, IN2+, IN2-
det = detector.SchDoc: RFIN (in), DET_OUT (out)
F1 = filter_bank.SchDoc: IN (in), OUT (out)
F1 = filter_bank.SchDoc: IN (in), OUT (out)
F1 = filter_bank.SchDoc: IN (in), OUT (out)
F2 = filter_bank.SchDoc: IN (in), OUT (out)
F2 = RF_AMP.SchDoc: IN (in), OUT (out)
IF1 = IF_amp.SchDoc: IN+ (in), OUT+ (out), IN- (in), OUT- (out)
IF2 = IF_amp.SchDoc: IN+ (in), OUT+ (out), IN- (in), OUT- (out)
LNA2 = LNA.SchDoc: IN (in), OUT (out)
LNA2 = LNA.SchDoc: IN (in), OUT (out)
LO = source.SchDoc: OUTA+ (out), OUTA- (out), OUTB+ (out), OUTB- (out)
mixer1 = mixer.SchDoc: IN+ (in), IN- (in), LO+ (in), LO- (in), OUT+ (out), OUT- (out)
mixer2 = mixer.SchDoc: IN+ (in), IN- (in), LO+ (in), LO- (in), OUT+ (out), OUT- (out)
sw = port_sw.SchDoc: IN (in), OUT (out), SW (in)
TX = source.SchDoc: OUTA+ (out), OUTA- (out)

### Nets
GND: R?.2
IF1_N: sheet IF1/IN+, sheet mixer1/OUT+
IF1_N: sheet IF1/IN-, sheet mixer1/OUT-  [a separate net that carries the same name]
IF1_N: sheet IF2/IN+, sheet mixer2/OUT+  [a separate net that carries the same name]
IF1_N: sheet IF2/IN-, sheet mixer2/OUT-  [a separate net that carries the same name]
IF2_N: sheet IF1/OUT+, sheet Designator/IN1+
IF2_N: sheet Designator/IN2+, sheet IF2/OUT+  [a separate net that carries the same name]
IF2_P: sheet IF1/OUT-, sheet Designator/IN1-
IF2_P: sheet Designator/IN2-, sheet IF2/OUT-  [a separate net that carries the same name]
NetC44_mixer1_1: sheet mixer1/IN+, sheet B1/DIFF+
NetC44_mixer2_1: sheet mixer2/IN+, sheet B1/DIFF+
NetC46_mixer1_1: sheet mixer1/IN-, sheet B1/DIFF-
NetC46_mixer2_1: sheet mixer2/IN-, sheet B1/DIFF-
NetC49_mixer1_1: sheet mixer1/LO+, sheet LO/OUTA+
NetC49_mixer2_1: sheet mixer2/LO+, sheet LO/OUTB+
NetC50_mixer1_1: sheet mixer1/LO-, sheet LO/OUTA-
NetC50_mixer2_1: sheet mixer2/LO-, sheet LO/OUTB-
NetC67_F1#1_2: sheet F1/IN, sheet LNA2/OUT
NetC67_F1#2_2: sheet TX/OUTA+, sheet F1/IN
NetC67_F1#3_2: sheet F2/OUT, sheet F1/IN, sheet det/RFIN
NetC67_F2_2: sheet F2/IN, sheet LNA2/OUT
NetC71_F1#1_1: sheet F1/OUT, sheet B1/SE
NetC71_F1#2_1: sheet F1/OUT, sheet att/IN
NetC71_F1#3_1: sheet F1/OUT, sheet sw/IN
NetC71_F2_1: sheet B1/SE, sheet F2/OUT
NetL5_TX_2: R?.1 ; sheet TX/OUTA-
(unnamed): sheet F2/IN, sheet att/OUT

### Library data of the parts
R? = Res2: Resistor; Published: 8-Jun-2000; LatestRevisionDate: 17-Jul-2002; LatestRevisionNote: Re-released for DXP Platform.; PackageReference: AXIAL-0.4; Publisher: Altium Limited; PackageDescription: Axial Device, Thru-Hole; 2 Leads; 0.4 in Pin Spacing

## Sheet IF_amp.SchDoc
size A4
Used 2 times, as channels IF1, IF2. Parts and nets are listed once, with the designators drawn on the sheet.
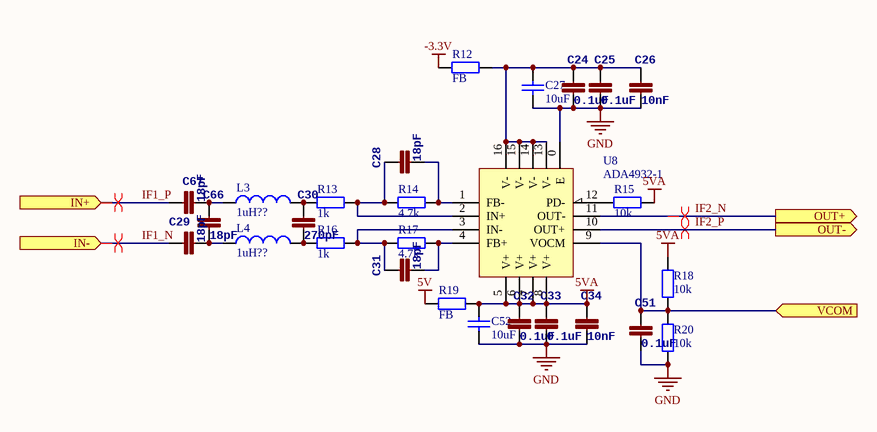
[diagram p5: IF_amp.SchDoc]

### Parts
C24  0.1uF  [0402]
C25  0.1uF  [0402]
C26  10nF  [0402]
C27  10uF  [0805]
C28  18pF  [0402]
C29  18pF  [0402]
C30  270pF  [0402]
C31  18pF  [0402]
C32  0.1uF  [0402]
C33  0.1uF  [0402]
C34  10nF  [0402]
C51  0.1uF  [0402]
C52  10uF  [0805]
C66  18pF  [0402]
C67  18pF  [0402]
L3  value 1uH??  [0805]  (hidden comment: Inductor)
L4  value 1uH??  [0805]  (hidden comment: Inductor)
R12  FB  [0603]
R13  value 1k  [0402]  (hidden comment: Res2)
R14  value 4.7k  [0402]  (hidden comment: Res2)
R15  value 10k  [0402]  (hidden comment: Res2)
R16  value 1k  [0402]  (hidden comment: Res2)
R17  value 4.7k  [0402]  (hidden comment: Res2)
R18  value 10k  [0402]  (hidden comment: Res2)
R19  FB  [0603]
R20  value 10k  [0402]  (hidden comment: Res2)
U8  ADA4932-1  [ADA4932-1]

### Ports
IN+ (in), IN- (in), OUT+ (out), OUT- (out), VCOM (in)

### Nets
5V: R19.1
5VA: C32.2 C33.2 C34.2 C52.1 R15.2 R18.2 R19.2 U8.5(V+) U8.6(V+) U8.7(V+) U8.8(V+)
-3.3V: R12.1
GND: C24.1 C25.1 C26.1 C27.2 C32.1 C33.1 C34.1 C51.1 C52.2 R20.1 U8.0(E)
IF1_N: C29.2 ; port IN-
IF1_P: C67.2 ; port IN+
IF2_N: U8.11(OUT-) ; port OUT+
IF2_P: U8.10(OUT+) ; port OUT-
VCOM: C51.2 R18.1 R20.2 U8.9(VOCM) ; port VCOM
NetC24_2: C24.2 C25.2 C26.2 C27.1 R12.2 U8.13(V-) U8.14(V-) U8.15(V-) U8.16(V-)
NetC28_1: C28.1 R14.2 U8.1(FB-)
NetC28_2: C28.2 R13.2 R14.1 U8.2(IN+)
NetC29_1: C29.1 C66.1 L4.1
NetC30_1: C30.1 L4.2 R16.1
NetC30_2: C30.2 L3.2 R13.1
NetC31_1: C31.1 R17.2 U8.4(FB+)
NetC31_2: C31.2 R16.2 R17.1 U8.3(IN-)
NetC66_2: C66.2 C67.1 L3.1
NetR15_1: R15.1 U8.12(PD-)

### Channels
IF1: designators end in _IF1; ports IN+=IF1_N IN-=IF1_N OUT+=IF2_N OUT-=IF2_P VCOM=NetC51_IF1_2
IF2: designators end in _IF2; ports IN+=IF1_N IN-=IF1_N OUT+=IF2_N OUT-=IF2_P VCOM=NetC51_IF2_2

### Layout directives
differential pair: IF1_N, IF2_N, IF2_P

### Library data of the parts
C24-C26 C28-C34 C51 C66 C67 = CAP0402-CAP: as C68 on sheet FPGA
C27 C52 = Cap: Capacitor; Published: 8-Jun-2000; LatestRevisionDate: 17-Jul-2002; LatestRevisionNote: Re-released for DXP Platform.; PackageReference: RAD-0.3; Publisher: Altium Limited; PackageDescription: Radial Cap, Thru-Hole; 2 Leads; 0.3 in Pin Spacing
L3 L4 = Inductor: Code_IEC: 1005; Published: 8-Jun-2000; LatestRevisionDate: 29-May-2009; LatestRevisionNote: IPC-7351 Footprint Added.; PackageReference: 0402-A; Publisher: Altium Limited; PackageDescription: Chip Inductor; Code_JEITA: 0402
R12 R19 = Res2: Resistor; Value: 0Ohm; Published: 8-Jun-2000; LatestRevisionDate: 17-Jul-2002; LatestRevisionNote: Re-released for DXP Platform.; PackageReference: AXIAL-0.4; Publisher: Altium Limited; PackageDescription: Axial Device, Thru-Hole; 2 Leads; 0.4 in Pin Spacing
R13-R18 R20 = Res2: Resistor; Published: 8-Jun-2000; LatestRevisionDate: 17-Jul-2002; LatestRevisionNote: Re-released for DXP Platform.; PackageReference: AXIAL-0.4; Publisher: Altium Limited; PackageDescription: Axial Device, Thru-Hole; 2 Leads; 0.4 in Pin Spacing

## Sheet ADC.SchDoc
size A4
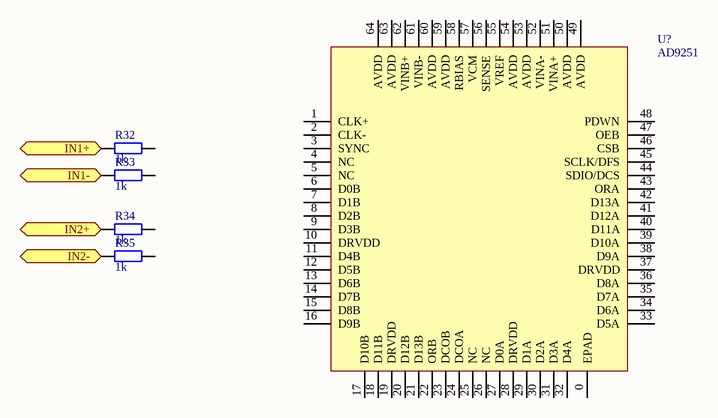
[diagram p6: ADC.SchDoc]

### Parts
R32  1k  [0402]
R33  1k  [0402]
R34  1k  [0402]
R35  1k  [0402]
U?  AD9251  [AD9251]

### Ports
IN1+ (in), IN1- (in), IN2+ (in), IN2- (in)

### Nets
IF2_N: R32.2 ; port IN1+
IF2_N: R34.2 ; port IN2+  [a separate net that carries the same name]
IF2_P: R33.2 ; port IN1-
IF2_P: R35.2 ; port IN2-  [a separate net that carries the same name]

Not connected (* = marked no-connect by the designer): R32 1; R33 1; R34 1; R35 1; U? 0(EPAD) 1(CLK+) 2(CLK-) 3(SYNC) 4(NC) 5(NC) 6(D0B) 7(D1B) 8(D2B) 9(D3B) 10(DRVDD) 11(D4B) 12(D5B) 13(D6B) 14(D7B) 15(D8B) 16(D9B) 17(D10B) 18(D11B) 19(DRVDD) 20(D12B) 21(D13B) 22(ORB) 23(DCOB) 24(DCOA) 25(NC) 26(NC) 27(D0A) 28(DRVDD) 29(D1A) 30(D2A) 31(D3A) 32(D4A) 33(D5A) 34(D6A) 35(D7A) 36(D8A) 37(DRVDD) 38(D9A) 39(D10A) 40(D11A) 41(D12A) 42(D13A) 43(ORA) 44(SDIO/DCS) 45(SCLK/DFS) 46(CSB) 47(OEB) 48(PDWN) 49(AVDD) 50(AVDD) 51(VINA+) 52(VINA-) 53(AVDD) 54(AVDD) 55(VREF) 56(SENSE) 57(VCM) 58(RBIAS) 59(AVDD) 60(AVDD) 61(VINB-) 62(VINB+) 63(AVDD) 64(AVDD)

### Library data of the parts
R32-R35 = Res2: Resistor; Published: 8-Jun-2000; LatestRevisionDate: 17-Jul-2002; LatestRevisionNote: Re-released for DXP Platform.; PackageReference: AXIAL-0.4; Publisher: Altium Limited; PackageDescription: Axial Device, Thru-Hole; 2 Leads; 0.4 in Pin Spacing

## Sheet mixer.SchDoc
size A4
Used 2 times, as channels mixer1, mixer2. Parts and nets are listed once, with the designators drawn on the sheet.
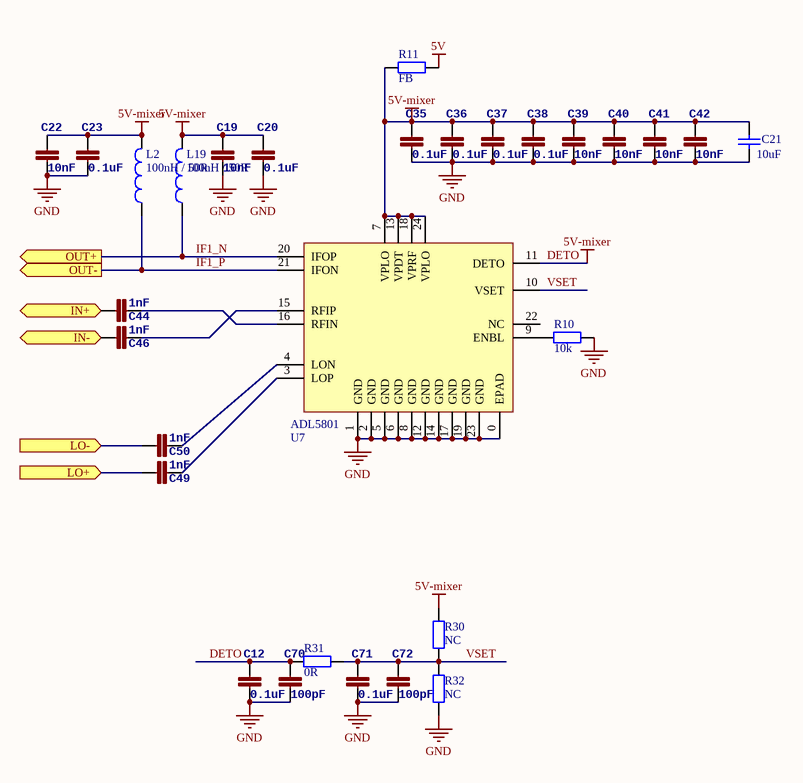
[diagram p7: mixer.SchDoc]

### Parts
C12  0.1uF  [0402]
C19  10nF  [0402]
C20  0.1uF  [0402]
C21  10uF  [0805]
C22  10nF  [0402]
C23  0.1uF  [0402]
C35  0.1uF  [0402]
C36  0.1uF  [0402]
C37  0.1uF  [0402]
C38  0.1uF  [0402]
C39  10nF  [0402]
C40  10nF  [0402]
C41  10nF  [0402]
C42  10nF  [0402]
C44  1nF  [0402]
C46  1nF  [0402]
C49  1nF  [0402]
C50  1nF  [0402]
C70  100pF  [0402]
C71  0.1uF  [0402]
C72  100pF  [0402]
L2  value 100nH / 50R  [0603]  (hidden comment: Inductor)
L19  value 100nH / 50R  [0603]  (hidden comment: Inductor)
R10  value 10k  [0402]  (hidden comment: Res2)
R11  FB  [0603]
R30  value NC  [0402]  (hidden comment: Res2)
R31  value 0R  [0402]  (hidden comment: Res2)
R32  value NC  [0402]  (hidden comment: Res2)
U7  ADL5801  [ADL5801]

### Ports
IN+ (in), IN- (in), LO+ (in), LO- (in), OUT+ (out), OUT- (out)

### Nets
5V: R11.2
DETO: C12.2 C19.2 C20.2 C21.2 C22.2 C23.2 C35.2 C36.2 C37.2 C38.2 C39.2 C40.2 C41.2 C42.2 C70.2 L2.2 L19.2 R11.1 R30.2 R31.1 U7.7(VPLO) U7.11(DETO) U7.13(VPDT) U7.18(VPRF) U7.24(VPLO)  [also labelled 5V-mixer]
GND: C12.1 C19.1 C20.1 C21.1 C22.1 C23.1 C35.1 C36.1 C37.1 C38.1 C39.1 C40.1 C41.1 C42.1 C70.1 C71.1 C72.1 R10.2 R32.1 U7.0(EPAD) U7.1(GND) U7.2(GND) U7.5(GND) U7.6(GND) U7.8(GND) U7.12(GND) U7.14(GND) U7.17(GND) U7.19(GND) U7.23(GND)
IF1_N: L19.1 U7.20(IFOP) ; port OUT+
IF1_P: L2.1 U7.21(IFON) ; port OUT-
IN+: C44.1 ; port IN+
IN-: C46.1 ; port IN-
LO+: C49.1 ; port LO+
LO-: C50.1 ; port LO-
VSET: C71.2 C72.2 R30.1 R31.2 R32.2 U7.10(VSET)
NetC44_2: C44.2 U7.16(RFIN)
NetC46_2: C46.2 U7.15(RFIP)
NetC49_2: C49.2 U7.3(LOP)
NetC50_2: C50.2 U7.4(LON)
NetR10_1: R10.1 U7.9(ENBL)

Not connected (* = marked no-connect by the designer): U7 22(NC)

### Channels
mixer1: designators end in _mixer1; ports IN+=NetC44_mixer1_1 IN-=NetC46_mixer1_1 LO+=NetC49_mixer1_1 LO-=NetC50_mixer1_1 OUT+=IF1_N OUT-=IF1_N
mixer2: designators end in _mixer2; ports IN+=NetC44_mixer2_1 IN-=NetC46_mixer2_1 LO+=NetC49_mixer2_1 LO-=NetC50_mixer2_1 OUT+=IF1_N OUT-=IF1_N

### Library data of the parts
C12 C19 C20 C22 C23 C35-C42 C44 C46 C49 C50 C70-C72 = CAP0402-CAP: as C68 on sheet FPGA
C21 = Cap: Capacitor; Published: 8-Jun-2000; LatestRevisionDate: 17-Jul-2002; LatestRevisionNote: Re-released for DXP Platform.; PackageReference: RAD-0.3; Publisher: Altium Limited; PackageDescription: Radial Cap, Thru-Hole; 2 Leads; 0.3 in Pin Spacing
L2 L19 = Inductor: Code_IEC: 1005; Published: 8-Jun-2000; LatestRevisionDate: 29-May-2009; LatestRevisionNote: IPC-7351 Footprint Added.; PackageReference: 0402-A; Publisher: Altium Limited; PackageDescription: Chip Inductor; Code_JEITA: 0402
R10 R30-R32 = Res2: Resistor; Published: 8-Jun-2000; LatestRevisionDate: 17-Jul-2002; LatestRevisionNote: Re-released for DXP Platform.; PackageReference: AXIAL-0.4; Publisher: Altium Limited; PackageDescription: Axial Device, Thru-Hole; 2 Leads; 0.4 in Pin Spacing
R11 = Res2: Resistor; Value: 0Ohm; Published: 8-Jun-2000; LatestRevisionDate: 17-Jul-2002; LatestRevisionNote: Re-released for DXP Platform.; PackageReference: AXIAL-0.4; Publisher: Altium Limited; PackageDescription: Axial Device, Thru-Hole; 2 Leads; 0.4 in Pin Spacing

## Sheet source.SchDoc
size A4
Used 2 times, as channels LO, TX. Parts and nets are listed once, with the designators drawn on the sheet.
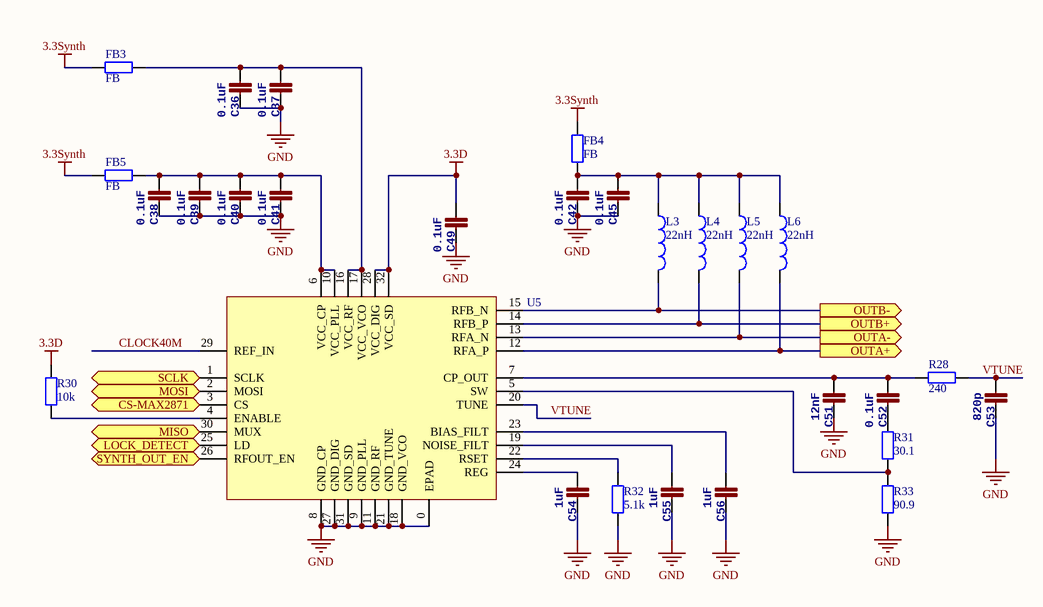
[diagram p8: source.SchDoc]

### Parts
C36  0.1uF  [0402]
C37  0.1uF  [0402]
C38  0.1uF  [0402]
C39  0.1uF  [0402]
C40  0.1uF  [0402]
C41  0.1uF  [0402]
C42  0.1uF  [0402]
C45  0.1uF  [0402]
C49  0.1uF  [0402]
C51  12nF  [0402]
C52  0.1uF  [0402]
C53  820p  [0402]
C54  1uF  [0402]
C55  1uF  [0402]
C56  1uF  [0402]
FB3  FB  [0603]
FB4  FB  [0603]
FB5  FB  [0603]
L3  value 22nH  [0402]  (hidden comment: Inductor)
L4  value 22nH  [0402]  (hidden comment: Inductor)
L5  value 22nH  [0402]  (hidden comment: Inductor)
L6  value 22nH  [0402]  (hidden comment: Inductor)
R28  240  [0402]
R30  10k  [0402]
R31  30.1  [0402]
R32  5.1k  [0402]
R33  90.9  [0402]
U5  MAX2871  [MAX2871]  (value not drawn)

### Ports
CS-MAX2871 (in), LOCK_DETECT, MISO, MOSI, OUTA+ (out), OUTA- (out), OUTB+ (out), OUTB- (out), SCLK (in), SYNTH_OUT_EN

### Nets
3.3D: C49.1 R30.2 U5.28(VCC_DIG) U5.32(VCC_SD)
3.3Synth: FB3.2 FB4.1 FB5.2
GND: C36.2 C37.2 C38.2 C39.2 C40.2 C41.2 C42.2 C45.2 C49.2 C51.2 C53.2 C54.2 C55.2 C56.2 R32.1 R33.1 U5.0(EPAD) U5.8(GND_CP) U5.9(GND_PLL) U5.11(GND_RF) U5.18(GND_VCO) U5.21(GND_TUNE) U5.27(GND_DIG) U5.31(GND_SD)
CLOCK40M: U5.29(REF_IN)
CS-MAX2871: U5.3(CS) ; port CS-MAX2871
LOCK_DETECT: U5.25(LD) ; port LOCK_DETECT
MISO: U5.30(MUX) ; port MISO
MOSI: U5.2(MOSI) ; port MOSI
OUTA+: L6.2 U5.12(RFA_P) ; port OUTA+
OUTA-: L5.2 U5.13(RFA_N) ; port OUTA-
OUTB+: L4.2 U5.14(RFB_P) ; port OUTB+
OUTB-: L3.2 U5.15(RFB_N) ; port OUTB-
SCLK: U5.1(SCLK) ; port SCLK
SYNTH_OUT_EN: U5.26(RFOUT_EN) ; port SYNTH_OUT_EN
VTUNE: C53.1 R28.1 U5.20(TUNE)
NetC36_1: C36.1 C37.1 FB3.1 U5.16(VCC_RF) U5.17(VCC_VCO)
NetC38_1: C38.1 C39.1 C40.1 C41.1 FB5.1 U5.6(VCC_CP) U5.10(VCC_PLL)
NetC42_1: C42.1 C45.1 FB4.2 L3.1 L4.1 L5.1 L6.1
NetC51_1: C51.1 C52.1 R28.2 U5.7(CP_OUT)
NetC52_2: C52.2 R31.2
NetC54_1: C54.1 U5.24(REG)
NetC55_1: C55.1 U5.19(NOISE_FILT)
NetC56_1: C56.1 U5.23(BIAS_FILT)
NetR30_1: R30.1 U5.4(ENABLE)
NetR31_1: R31.1 R33.2 U5.5(SW)
NetR32_2: R32.2 U5.22(RSET)

### Channels
LO: designators end in _LO; ports CS-MAX2871=NetU5_LO_3 LOCK_DETECT=NetU5_LO_25 MISO=NetU5_LO_30 MOSI=NetU5_LO_2 OUTA+=NetC49_mixer1_1 OUTA-=NetC50_mixer1_1 OUTB+=NetC49_mixer2_1 OUTB-=NetC50_mixer2_1 SCLK=NetU5_LO_1 SYNTH_OUT_EN=NetU5_LO_26
TX: designators end in _TX; ports CS-MAX2871=NetU5_TX_3 LOCK_DETECT=NetU5_TX_25 MISO=NetU5_TX_30 MOSI=NetU5_TX_2 OUTA+=NetC67_F1#2_2 OUTA-=NetL5_TX_2 OUTB+=NetL4_TX_2 OUTB-=NetL3_TX_2 SCLK=NetU5_TX_1 SYNTH_OUT_EN=NetU5_TX_26

### Library data of the parts
C36-C42 C45 C49 C51-C56 = CAP0402-CAP: as C68 on sheet FPGA
FB3-FB5 R28 R30-R33 = Res2: Resistor; Published: 8-Jun-2000; LatestRevisionDate: 17-Jul-2002; LatestRevisionNote: Re-released for DXP Platform.; PackageReference: AXIAL-0.4; Publisher: Altium Limited; PackageDescription: Axial Device, Thru-Hole; 2 Leads; 0.4 in Pin Spacing
L3-L6 = Inductor: Code_IEC: 1005; Published: 8-Jun-2000; LatestRevisionDate: 29-May-2009; LatestRevisionNote: IPC-7351 Footprint Added.; PackageReference: 0402-A; Publisher: Altium Limited; PackageDescription: Chip Inductor; Code_JEITA: 0402

## Sheet filter_bank.SchDoc
size A3
Used 4 times, as channels F1, F2, F1, F1. Parts and nets are listed once, with the designators drawn on the sheet.
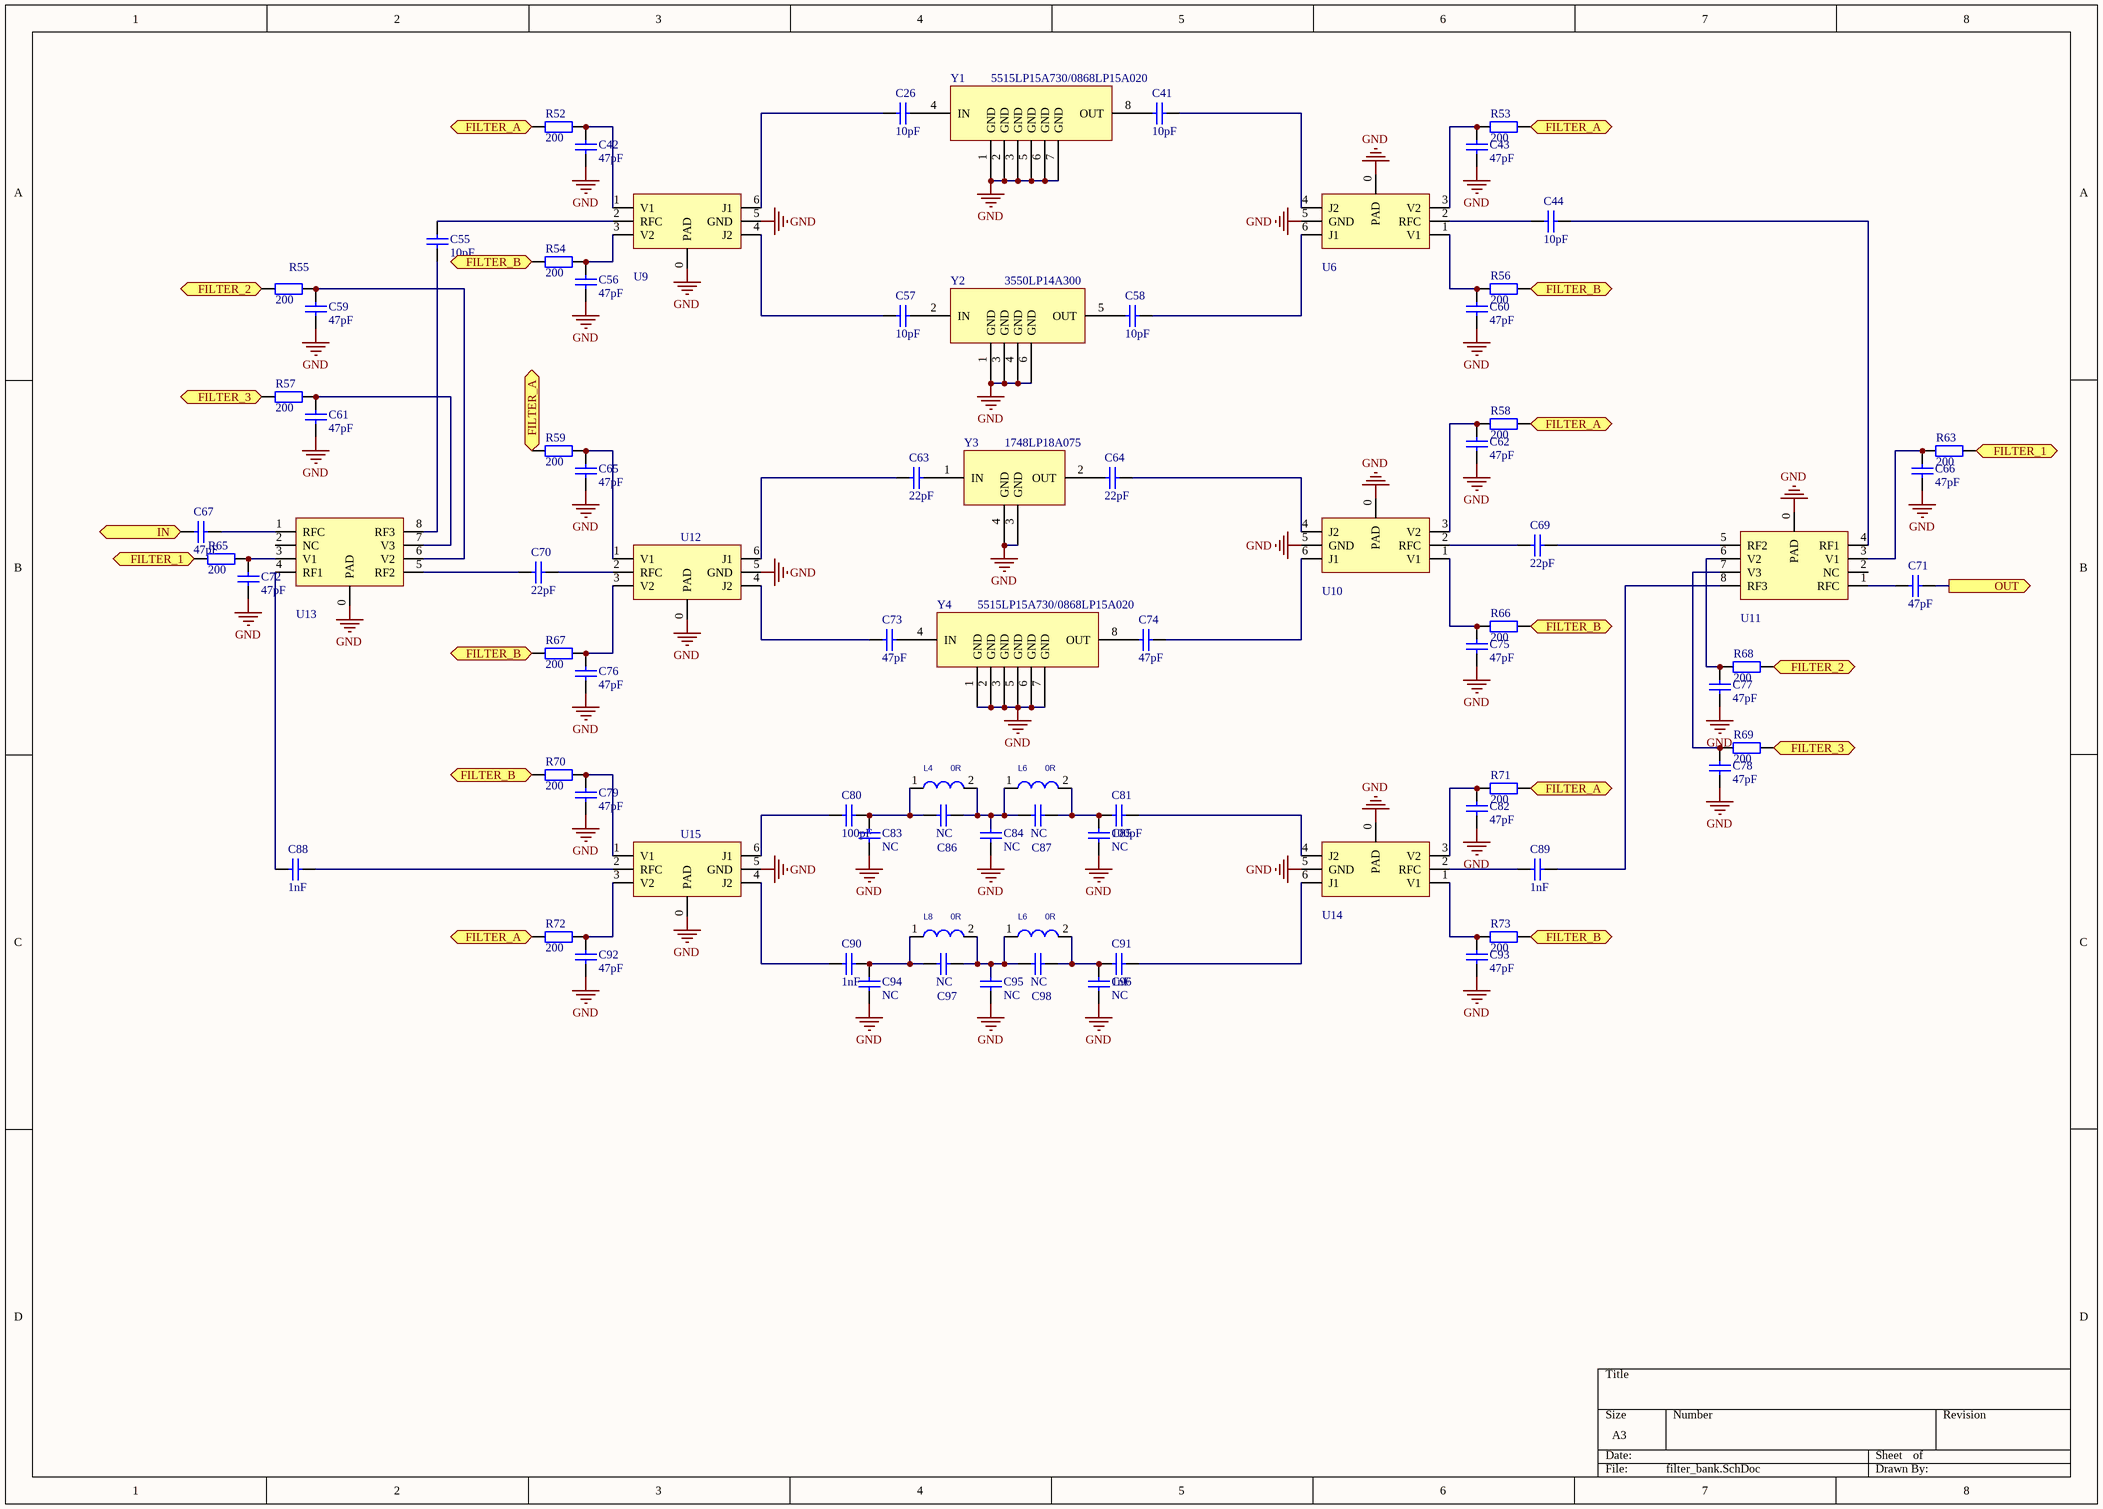
[diagram p9: filter_bank.SchDoc]

### Parts
(Parts that share a designator on the sheet are numbered #1, #2 ... from top to bottom, then left to right.)
C26  10pF  [0402]
C41  10pF  [0402]
C42  47pF  [0402]
C43  47pF  [0402]
C44  10pF  [0402]
C55  10pF  [0402]
C56  47pF  [0402]
C57  10pF  [0402]
C58  10pF  [0402]
C59  47pF  [0402]
C60  47pF  [0402]
C61  47pF  [0402]
C62  47pF  [0402]
C63  22pF  [0402]
C64  22pF  [0402]
C65  47pF  [0402]
C66  47pF  [0402]
C67  47pF  [0402]
C69  22pF  [0402]
C70  22pF  [0402]
C71  47pF  [0402]
C72  47pF  [0402]
C73  47pF  [0402]
C74  47pF  [0402]
C75  47pF  [0402]
C76  47pF  [0402]
C77  47pF  [0402]
C78  47pF  [0402]
C79  47pF  [0402]
C80  100pF  [0402]
C81  100pF  [0402]
C82  47pF  [0402]
C83  NC  [0402]
C84  NC  [0402]
C85  NC  [0402]
C86  NC  [0402]
C87  NC  [0402]
C88  1nF  [0402]
C89  1nF  [0402]
C90  1nF  [0402]
C91  1nF  [0402]
C92  47pF  [0402]
C93  47pF  [0402]
C94  NC  [0402]
C95  NC  [0402]
C96  NC  [0402]
C97  NC  [0402]
C98  NC  [0402]
L4  0R  [0402]
L6#1  0R  [0402]
L6#2  0R  [0402]
L8  0R  [0402]
R52  200  [0402]
R53  200  [0402]
R54  200  [0402]
R55  200  [0402]
R56  200  [0402]
R57  200  [0402]
R58  200  [0402]
R59  200  [0402]
R63  200  [0402]
R65  200  [0402]
R66  200  [0402]
R67  200  [0402]
R68  200  [0402]
R69  200  [0402]
R70  200  [0402]
R71  200  [0402]
R72  200  [0402]
R73  200  [0402]
U6  SKY13320  [SKY65404-31]  (value not drawn)
U9  SKY13320  [SKY65404-31]  (value not drawn)
U10  SKY13320  [SKY65404-31]  (value not drawn)
U11  SKY13417  [SKY13317]  (value not drawn)
U12  SKY13320  [SKY65404-31]  (value not drawn)
U13  SKY13417  [SKY13317]  (value not drawn)
U14  SKY13320  [SKY65404-31]  (value not drawn)
U15  SKY13320  [SKY65404-31]  (value not drawn)
Y1  5515LP15A730/0868LP15A020  [5515LP15A730/0868LP15A020]
Y2  3550LP14A300  [3550LP14A300]
Y3  1748LP18A075  [1748LP18A075]
Y4  5515LP15A730/0868LP15A020  [5515LP15A730/0868LP15A020]

### Ports
FILTER_1, FILTER_2, FILTER_3, FILTER_A, FILTER_B, IN (in), OUT (out)

### Nets
GND: C42.1 C43.1 C56.1 C59.1 C60.1 C61.1 C62.1 C65.1 C66.1 C72.1 C75.1 C76.1 C77.1 C78.1 C79.1 C82.1 C83.1 C84.1 C85.1 C92.1 C93.1 C94.1 C95.1 C96.1 U6.0(PAD) U6.5(GND) U9.0(PAD) U9.5(GND) U10.0(PAD) U10.5(GND) U11.0(PAD) U12.0(PAD) U12.5(GND) U13.0(PAD) U14.0(PAD) U14.5(GND) U15.0(PAD) U15.5(GND) Y1.1(GND) Y1.2(GND) Y1.3(GND) Y1.5(GND) Y1.6(GND) Y1.7(GND) Y2.1(GND) Y2.3(GND) Y2.4(GND) Y2.6(GND) Y3.3(GND) Y3.4(GND) Y4.1(GND) Y4.2(GND) Y4.3(GND) Y4.5(GND) Y4.6(GND) Y4.7(GND)
FILTER_1: R63.2 R65.1 ; port FILTER_1
FILTER_2: R55.2 R68.2 ; port FILTER_2
FILTER_3: R57.1 R69.2 ; port FILTER_3
FILTER_A: R52.1 R53.2 R58.2 R59.2 R71.2 R72.1 ; port FILTER_A
FILTER_B: R54.1 R56.2 R66.2 R67.1 R70.1 R73.2 ; port FILTER_B
IN: C67.2 ; port IN
OUT: C71.1 ; port OUT
NetC26_1: C26.1 Y1.4(IN)
NetC26_2: C26.2 U9.6(J1)
NetC41_1: C41.1 U6.4(J2)
NetC41_2: C41.2 Y1.8(OUT)
NetC42_2: C42.2 R52.2 U9.1(V1)
NetC43_2: C43.2 R53.1 U6.3(V2)
NetC44_1: C44.1 U11.4(RF1)
NetC44_2: C44.2 U6.2(RFC)
NetC55_1: C55.1 U9.2(RFC)
NetC55_2: C55.2 U13.8(RF3)
NetC56_2: C56.2 R54.2 U9.3(V2)
NetC57_1: C57.1 Y2.2(IN)
NetC57_2: C57.2 U9.4(J2)
NetC58_1: C58.1 U6.6(J1)
NetC58_2: C58.2 Y2.5(OUT)
NetC59_2: C59.2 R55.1 U13.6(V2)
NetC60_2: C60.2 R56.1 U6.1(V1)
NetC61_2: C61.2 R57.2 U13.7(V3)
NetC62_2: C62.2 R58.1 U10.3(V2)
NetC63_1: C63.1 Y3.1(IN)
NetC63_2: C63.2 U12.6(J1)
NetC64_1: C64.1 Y3.2(OUT)
NetC64_2: C64.2 U10.4(J2)
NetC65_2: C65.2 R59.1 U12.1(V1)
NetC66_2: C66.2 R63.1 U11.3(V1)
NetC67_1: C67.1 U13.1(RFC)
NetC69_1: C69.1 U11.5(RF2)
NetC69_2: C69.2 U10.2(RFC)
NetC70_1: C70.1 U12.2(RFC)
NetC70_2: C70.2 U13.5(RF2)
NetC71_2: C71.2 U11.1(RFC)
NetC72_2: C72.2 R65.2 U13.3(V1)
NetC73_1: C73.1 Y4.4(IN)
NetC73_2: C73.2 U12.4(J2)
NetC74_1: C74.1 U10.6(J1)
NetC74_2: C74.2 Y4.8(OUT)
NetC75_2: C75.2 R66.1 U10.1(V1)
NetC76_2: C76.2 R67.2 U12.3(V2)
NetC77_2: C77.2 R68.1 U11.6(V2)
NetC78_2: C78.2 R69.1 U11.7(V3)
NetC79_2: C79.2 R70.2 U15.1(V1)
NetC80_1: C80.1 C83.2 C86.2 L4.1
NetC80_2: C80.2 U15.6(J1)
NetC81_1: C81.1 U14.4(J2)
NetC81_2: C81.2 C85.2 C87.1 L6#1.2
NetC82_2: C82.2 R71.1 U14.3(V2)
NetC84_2: C84.2 C86.1 C87.2 L4.2 L6#1.1
NetC88_1: C88.1 U15.2(RFC)
NetC88_2: C88.2 U13.4(RF1)
NetC89_1: C89.1 U11.8(RF3)
NetC89_2: C89.2 U14.2(RFC)
NetC90_1: C90.1 C94.2 C97.2 L8.1
NetC90_2: C90.2 U15.4(J2)
NetC91_1: C91.1 U14.6(J1)
NetC91_2: C91.2 C96.2 C98.1 L6#2.2
NetC92_2: C92.2 R72.2 U15.3(V2)
NetC93_2: C93.2 R73.1 U14.1(V1)
NetC95_2: C95.2 C97.1 C98.2 L6#2.1 L8.2

Not connected (* = marked no-connect by the designer): U11 2(NC); U13 2(NC)

### Channels
F1: designators C26=C26_F1#1 C41=C41_F1#1 C42=C42_F1#1 C43=C43_F1#1 C44=C44_F1#1 C55=C55_F1#1 C56=C56_F1#1 C57=C57_F1#1 C58=C58_F1#1 C59=C59_F1#1 C60=C60_F1#1 C61=C61_F1#1 C62=C62_F1#1 C63=C63_F1#1 C64=C64_F1#1 C65=C65_F1#1 C66=C66_F1#1 C67=C67_F1#1 C69=C69_F1#1 C70=C70_F1#1 C71=C71_F1#1 C72=C72_F1#1 C73=C73_F1#1 C74=C74_F1#1 C75=C75_F1#1 C76=C76_F1#1 C77=C77_F1#1 C78=C78_F1#1 C79=C79_F1#1 C80=C80_F1#1 C81=C81_F1#1 C82=C82_F1#1 C83=C83_F1#1 C84=C84_F1#1 C85=C85_F1#1 C86=C86_F1#1 C87=C87_F1#1 C88=C88_F1#1 C89=C89_F1#1 C90=C90_F1#1 C91=C91_F1#1 C92=C92_F1#1 C93=C93_F1#1 C94=C94_F1#1 C95=C95_F1#1 C96=C96_F1#1 C97=C97_F1#1 C98=C98_F1#1 L4=L4_F1#1 L6=L6_F1#1 L6=L6_F1#2 L8=L8_F1#1 R52=R52_F1#1 R53=R53_F1#1 R54=R54_F1#1 R55=R55_F1#1 R56=R56_F1#1 R57=R57_F1#1 R58=R58_F1#1 R59=R59_F1#1 R63=R63_F1#1 R65=R65_F1#1 R66=R66_F1#1 R67=R67_F1#1 R68=R68_F1#1 R69=R69_F1#1 R70=R70_F1#1 R71=R71_F1#1 R72=R72_F1#1 R73=R73_F1#1 U6=U6_F1#1 U9=U9_F1#1 U10=U10_F1#1 U11=U11_F1#1 U12=U12_F1#1 U13=U13_F1#1 U14=U14_F1#1 U15=U15_F1#1 Y1=Y1_F1#1 Y2=Y2_F1#1 Y3=Y3_F1#1 Y4=Y4_F1#1; ports FILTER_1=NetR63_F1#1_2 FILTER_2=NetR55_F1#1_2 FILTER_3=NetR57_F1#1_1 FILTER_A=NetR52_F1#1_1 FILTER_B=NetR54_F1#1_1 IN=NetC67_F1#1_2 OUT=NetC71_F1#1_1
F2: designators C26=C26_F2 C41=C41_F2 C42=C42_F2 C43=C43_F2 C44=C44_F2 C55=C55_F2 C56=C56_F2 C57=C57_F2 C58=C58_F2 C59=C59_F2 C60=C60_F2 C61=C61_F2 C62=C62_F2 C63=C63_F2 C64=C64_F2 C65=C65_F2 C66=C66_F2 C67=C67_F2 C69=C69_F2 C70=C70_F2 C71=C71_F2 C72=C72_F2 C73=C73_F2 C74=C74_F2 C75=C75_F2 C76=C76_F2 C77=C77_F2 C78=C78_F2 C79=C79_F2 C80=C80_F2 C81=C81_F2 C82=C82_F2 C83=C83_F2 C84=C84_F2 C85=C85_F2 C86=C86_F2 C87=C87_F2 C88=C88_F2 C89=C89_F2 C90=C90_F2 C91=C91_F2 C92=C92_F2 C93=C93_F2 C94=C94_F2 C95=C95_F2 C96=C96_F2 C97=C97_F2 C98=C98_F2 L4=L4_F2 L6=L6_F2#1 L6=L6_F2#2 L8=L8_F2 R52=R52_F2 R53=R53_F2 R54=R54_F2 R55=R55_F2 R56=R56_F2 R57=R57_F2 R58=R58_F2 R59=R59_F2 R63=R63_F2 R65=R65_F2 R66=R66_F2 R67=R67_F2 R68=R68_F2 R69=R69_F2 R70=R70_F2 R71=R71_F2 R72=R72_F2 R73=R73_F2 U6=U6_F2 U9=U9_F2 U10=U10_F2 U11=U11_F2 U12=U12_F2 U13=U13_F2 U14=U14_F2 U15=U15_F2 Y1=Y1_F2 Y2=Y2_F2 Y3=Y3_F2 Y4=Y4_F2; ports FILTER_1=NetR63_F2_2 FILTER_2=NetR55_F2_2 FILTER_3=NetR57_F2_1 FILTER_A=NetR52_F2_1 FILTER_B=NetR54_F2_1 IN=NetC67_F2_2 OUT=NetC71_F2_1
F1: designators C26=C26_F1#2 C41=C41_F1#2 C42=C42_F1#2 C43=C43_F1#2 C44=C44_F1#2 C55=C55_F1#2 C56=C56_F1#2 C57=C57_F1#2 C58=C58_F1#2 C59=C59_F1#2 C60=C60_F1#2 C61=C61_F1#2 C62=C62_F1#2 C63=C63_F1#2 C64=C64_F1#2 C65=C65_F1#2 C66=C66_F1#2 C67=C67_F1#2 C69=C69_F1#2 C70=C70_F1#2 C71=C71_F1#2 C72=C72_F1#2 C73=C73_F1#2 C74=C74_F1#2 C75=C75_F1#2 C76=C76_F1#2 C77=C77_F1#2 C78=C78_F1#2 C79=C79_F1#2 C80=C80_F1#2 C81=C81_F1#2 C82=C82_F1#2 C83=C83_F1#2 C84=C84_F1#2 C85=C85_F1#2 C86=C86_F1#2 C87=C87_F1#2 C88=C88_F1#2 C89=C89_F1#2 C90=C90_F1#2 C91=C91_F1#2 C92=C92_F1#2 C93=C93_F1#2 C94=C94_F1#2 C95=C95_F1#2 C96=C96_F1#2 C97=C97_F1#2 C98=C98_F1#2 L4=L4_F1#2 L6=L6_F1#3 L6=L6_F1#4 L8=L8_F1#2 R52=R52_F1#2 R53=R53_F1#2 R54=R54_F1#2 R55=R55_F1#2 R56=R56_F1#2 R57=R57_F1#2 R58=R58_F1#2 R59=R59_F1#2 R63=R63_F1#2 R65=R65_F1#2 R66=R66_F1#2 R67=R67_F1#2 R68=R68_F1#2 R69=R69_F1#2 R70=R70_F1#2 R71=R71_F1#2 R72=R72_F1#2 R73=R73_F1#2 U6=U6_F1#2 U9=U9_F1#2 U10=U10_F1#2 U11=U11_F1#2 U12=U12_F1#2 U13=U13_F1#2 U14=U14_F1#2 U15=U15_F1#2 Y1=Y1_F1#2 Y2=Y2_F1#2 Y3=Y3_F1#2 Y4=Y4_F1#2; ports FILTER_1=NetR63_F1#2_2 FILTER_2=NetR55_F1#2_2 FILTER_3=NetR57_F1#2_1 FILTER_A=NetR52_F1#2_1 FILTER_B=NetR54_F1#2_1 IN=NetC67_F1#2_2 OUT=NetC71_F1#2_1
F1: designators C26=C26_F1#3 C41=C41_F1#3 C42=C42_F1#3 C43=C43_F1#3 C44=C44_F1#3 C55=C55_F1#3 C56=C56_F1#3 C57=C57_F1#3 C58=C58_F1#3 C59=C59_F1#3 C60=C60_F1#3 C61=C61_F1#3 C62=C62_F1#3 C63=C63_F1#3 C64=C64_F1#3 C65=C65_F1#3 C66=C66_F1#3 C67=C67_F1#3 C69=C69_F1#3 C70=C70_F1#3 C71=C71_F1#3 C72=C72_F1#3 C73=C73_F1#3 C74=C74_F1#3 C75=C75_F1#3 C76=C76_F1#3 C77=C77_F1#3 C78=C78_F1#3 C79=C79_F1#3 C80=C80_F1#3 C81=C81_F1#3 C82=C82_F1#3 C83=C83_F1#3 C84=C84_F1#3 C85=C85_F1#3 C86=C86_F1#3 C87=C87_F1#3 C88=C88_F1#3 C89=C89_F1#3 C90=C90_F1#3 C91=C91_F1#3 C92=C92_F1#3 C93=C93_F1#3 C94=C94_F1#3 C95=C95_F1#3 C96=C96_F1#3 C97=C97_F1#3 C98=C98_F1#3 L4=L4_F1#3 L6=L6_F1#5 L6=L6_F1#6 L8=L8_F1#3 R52=R52_F1#3 R53=R53_F1#3 R54=R54_F1#3 R55=R55_F1#3 R56=R56_F1#3 R57=R57_F1#3 R58=R58_F1#3 R59=R59_F1#3 R63=R63_F1#3 R65=R65_F1#3 R66=R66_F1#3 R67=R67_F1#3 R68=R68_F1#3 R69=R69_F1#3 R70=R70_F1#3 R71=R71_F1#3 R72=R72_F1#3 R73=R73_F1#3 U6=U6_F1#3 U9=U9_F1#3 U10=U10_F1#3 U11=U11_F1#3 U12=U12_F1#3 U13=U13_F1#3 U14=U14_F1#3 U15=U15_F1#3 Y1=Y1_F1#3 Y2=Y2_F1#3 Y3=Y3_F1#3 Y4=Y4_F1#3; ports FILTER_1=NetR63_F1#3_2 FILTER_2=NetR55_F1#3_2 FILTER_3=NetR57_F1#3_1 FILTER_A=NetR52_F1#3_1 FILTER_B=NetR54_F1#3_1 IN=NetC67_F1#3_2 OUT=NetC71_F1#3_1

### Library data of the parts
C26 C41-C44 C55-C67 C69-C98 = Cap: Capacitor; Published: 8-Jun-2000; LatestRevisionDate: 17-Jul-2002; LatestRevisionNote: Re-released for DXP Platform.; PackageReference: RAD-0.3; Publisher: Altium Limited; PackageDescription: Radial Cap, Thru-Hole; 2 Leads; 0.3 in Pin Spacing
L4 L6#1 L6#2 L8 = L/2.5*2.0
R52-R59 R63 R65-R73 = Res2: Resistor; Published: 8-Jun-2000; LatestRevisionDate: 17-Jul-2002; LatestRevisionNote: Re-released for DXP Platform.; PackageReference: AXIAL-0.4; Publisher: Altium Limited; PackageDescription: Axial Device, Thru-Hole; 2 Leads; 0.4 in Pin Spacing

## Sheet Balun.SchDoc
size A4
Used 2 times, as channels B1, B1. Parts and nets are listed once, with the designators drawn on the sheet.
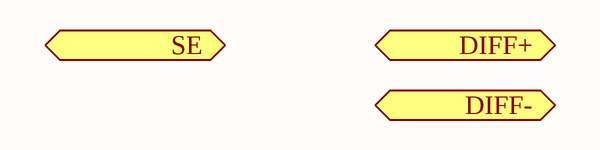
[diagram p10: Balun.SchDoc]

### Ports
DIFF+ (bidir), DIFF- (bidir), SE (bidir)

### Channels
B1: ports DIFF+=NetC44_mixer1_1 DIFF-=NetC46_mixer1_1 SE=NetC71_F1#1_1
B1: ports DIFF+=NetC44_mixer2_1 DIFF-=NetC46_mixer2_1 SE=NetC71_F2_1

## Sheet RF_AMP.SchDoc
size A4
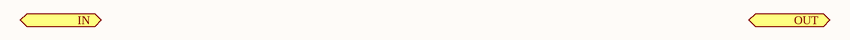
[diagram p11: RF_AMP.SchDoc]

### Ports
IN (in), OUT (out)

## Sheet detector.SchDoc
size A4
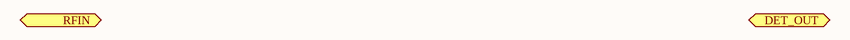
[diagram p12: detector.SchDoc]

### Ports
DET_OUT (out), RFIN (in)

## Sheet attenuator.SchDoc
size A4
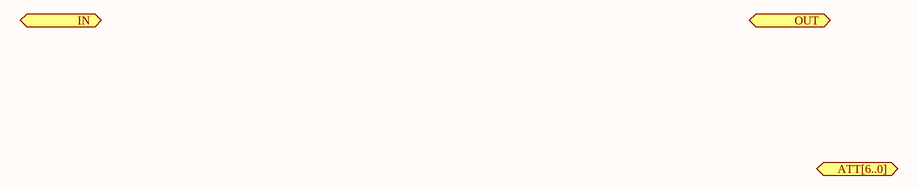
[diagram p13: attenuator.SchDoc]

### Ports
ATT[6..0] (in), IN (in), OUT (out)

## Sheet port_sw.SchDoc
size A4
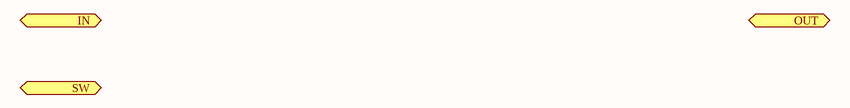
[diagram p14: port_sw.SchDoc]

### Ports
IN (in), OUT (out), SW (in)

## Sheet LNA.SchDoc
size A4
Used 2 times, as channels LNA2, LNA2. Parts and nets are listed once, with the designators drawn on the sheet.
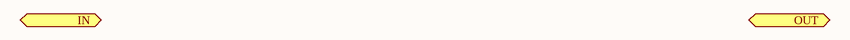
[diagram p15: LNA.SchDoc]

### Ports
IN (in), OUT (out)

### Channels
LNA2: ports IN=open OUT=NetC67_F2_2
LNA2: ports IN=open OUT=NetC67_F1#1_2

## Nets that join several sheets
3.3D: FPGA (46 pins), mcu (16 pins), LCD (7 pins), USB_HS_PHY (7 pins), LO (C49_LO.1 R30_LO.2 U5_LO.28 U5_LO.32), TX (C49_TX.1 R30_TX.2 U5_TX.28 U5_TX.32)
3.3Synth: LO (FB3_LO.2 FB4_LO.1 FB5_LO.2), TX (FB3_TX.2 FB4_TX.1 FB5_TX.2)
5V: mcu (P2.1), USB_HS_PHY (R46.1 R60.1), IF1 (R19_IF1.1), IF2 (R19_IF2.1), mixer1 (R11_mixer1.2), mixer2 (R11_mixer2.2)
5VA: IF1 (11 pins), IF2 (11 pins)
-3.3V: IF1 (R12_IF1.1), IF2 (R12_IF2.1)
DETO: mixer1 (25 pins), mixer2 (25 pins)
GND: FPGA (49 pins), mcu (15 pins), LCD (17 pins), USB_HS_PHY (10 pins), channel (R?.2), IF1 (11 pins), IF2 (11 pins), mixer1 (30 pins), mixer2 (30 pins), LO (24 pins), F1 (56 pins), F2 (56 pins), TX (24 pins), F1 (56 pins), F1 (56 pins)
IF1_N: IF1 (C67_IF1.2), mixer1 (L19_mixer1.1 U7_mixer1.20)
IF1_N: IF1 (C29_IF1.2), mixer1 (L2_mixer1.1 U7_mixer1.21)
IF1_N: IF2 (C67_IF2.2), mixer2 (L19_mixer2.1 U7_mixer2.20)
IF1_N: IF2 (C29_IF2.2), mixer2 (L2_mixer2.1 U7_mixer2.21)
IF2_N: IF1 (U8_IF1.11), ADC (R32.2)
IF2_N: ADC (R34.2), IF2 (U8_IF2.11)
IF2_P: IF1 (U8_IF1.10), ADC (R33.2)
IF2_P: ADC (R35.2), IF2 (U8_IF2.10)
NetC49_mixer1_1: mixer1 (C49_mixer1.1), LO (L6_LO.2 U5_LO.12)
NetC49_mixer2_1: mixer2 (C49_mixer2.1), LO (L4_LO.2 U5_LO.14)
NetC50_mixer1_1: mixer1 (C50_mixer1.1), LO (L5_LO.2 U5_LO.13)
NetC50_mixer2_1: mixer2 (C50_mixer2.1), LO (L3_LO.2 U5_LO.15)
NetC67_F1#2_2: TX (L6_TX.2 U5_TX.12), F1 (C67_F1#2.2)
NetL5_TX_2: channel (R?.1), TX (L5_TX.2 U5_TX.13)